# EAGLE design TelemetryECU rev2 (EAGLE 9.5.0)

## Sheet 1 of 3: Teensy, Power, and I/O
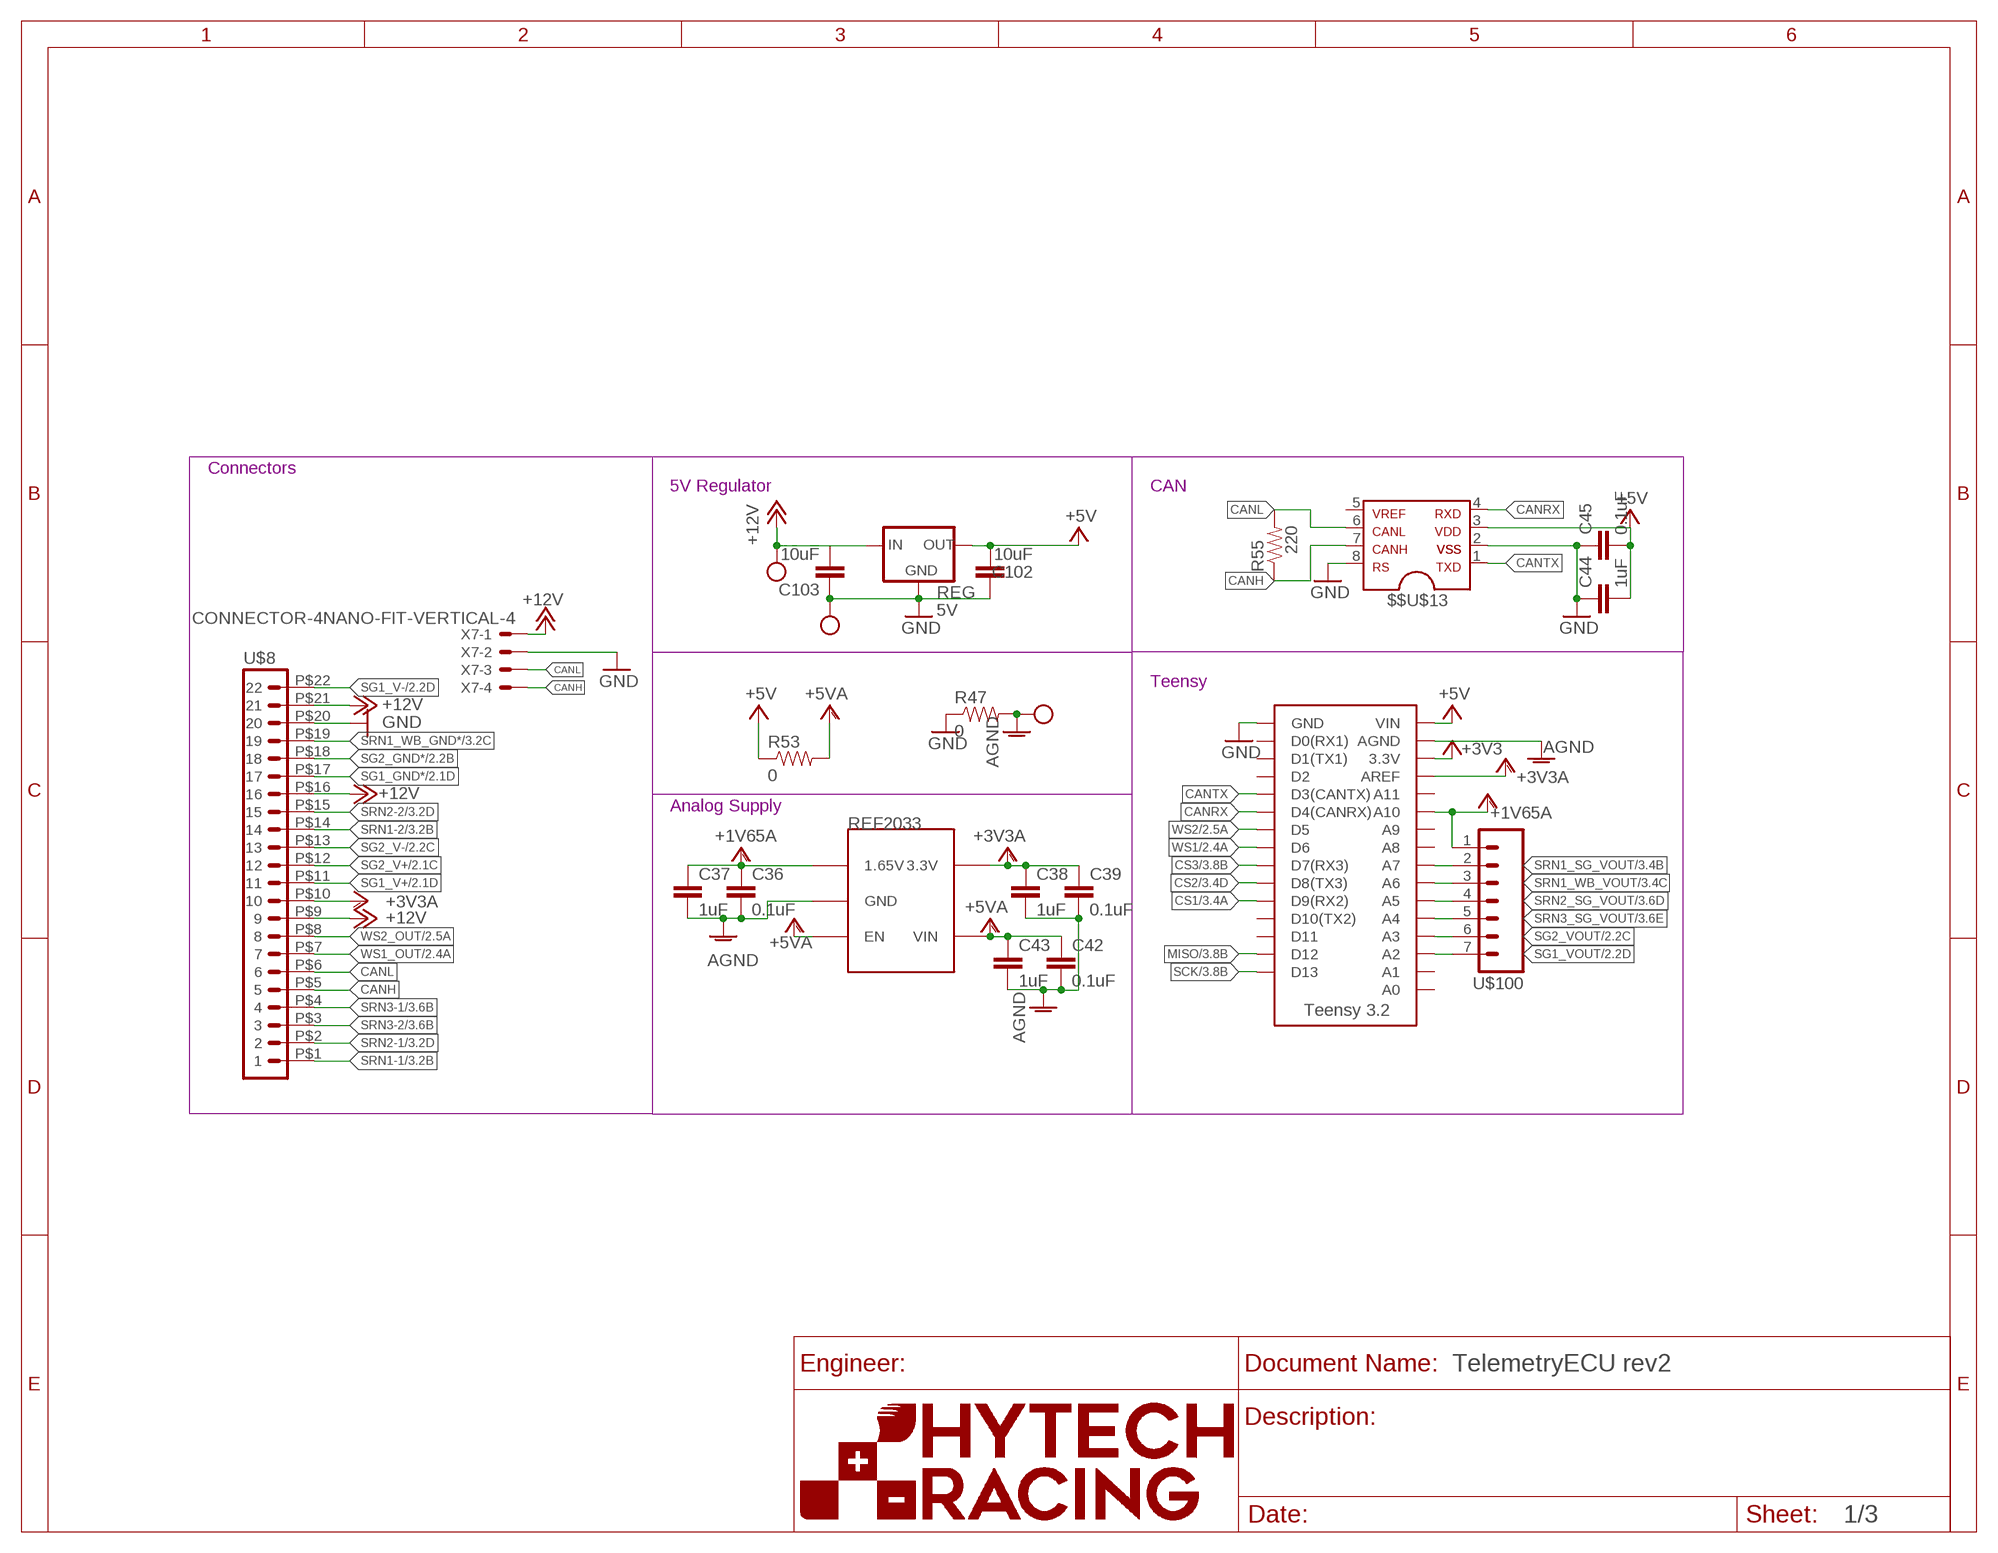
[diagram p0: schematic, sheet 1]
U$13 (FRAME_A_L): ORIENTATION: LANDSCAPE; SIZE: A

### Parts
$$U$11  TEST_POINT  [TEST_POINT]
$$U$13  MCP2551  [SOIC-08]
C36  0.1uF  CAP0603-CAP  [0603-CAP]
C37  1uF  CAP0603-CAP  [0603-CAP]
C38  1uF  CAP0603-CAP  [0603-CAP]
C39  0.1uF  CAP0603-CAP  [0603-CAP]
C42  0.1uF  CAP0603-CAP  [0603-CAP]
C43  1uF  CAP0603-CAP  [0603-CAP]
C44  1uF  CAP0603-CAP  [0603-CAP]
C45  0.1uF  CAP0603-CAP  [0603-CAP]
C102  10uF  CAP0603-CAP  [0603-CAP]
C103  10uF  CAP0603-CAP  [0603-CAP]
R47  0  RESISTOR0603  [0603-RES]
R53  0  RESISTOR0603  [0603-RES]
R55  220  RESISTOR0603-RES  [0603-RES]
REG  5V  OKI-78SR-5  [OKI-78SR]
U$7  REF2033  [SOT-23-5]
U$8  CONNECTOR-22  [AUTOSPORT_12-35]
U$9  TEST_POINT  [TEST_POINT]
U$10  TEST_POINT  [TEST_POINT]
U$14  TEENSY_3.2_EXT_12ANALOG_AREF  [TEENSY_3.2_EXT_12ANALOG_AREF]
U$100  M07  [1X07]
X7  CONNECTOR-4NANO-FIT-VERTICAL-4  [NANO-FIT_VERTICAL-4]

### Nets
+1V65A: C36.1 C37.1 U$7.1(1.65V) U$14.A10 U$100.1 ; also sheet 2,3
+3V3: U$14.3.3V ; also sheet 2,3
+3V3A: C38.1 C39.1 U$7.5(3.3V) U$8.P$10 U$14.AREF ; also sheet 2,3
+5V: $$U$13.3 C44.2 C45.2 C102.2 R53.1 REG.3(OUT) U$14.VIN
+5VA: C42.1 C43.1 R53.2 U$7.3(EN) U$7.4(VIN) ; also sheet 2,3
+12V: C103.2 REG.1(IN) U$8.P$9 U$8.P$16 U$8.P$21 U$10.P$1 X7.P$1
AGND: $$U$11.P$1 C36.2 C37.2 C38.2 C39.2 C42.2 C43.2 R47.2 U$7.2(GND) U$14.AGND ; also sheet 2,3
CANH: $$U$13.7 R55.1 U$8.P$5 X7.P$4
CANL: $$U$13.6 R55.2 U$8.P$6 X7.P$3
CANRX: $$U$13.4 U$14.D4(CANRX)
CANTX: $$U$13.1 U$14.D3(CANTX)
CS1: U$14.D9(RX2) ; also sheet 3
CS2: U$14.D8(TX3) ; also sheet 3
CS3: U$14.D7(RX3) ; also sheet 3
GND: $$U$13.2 $$U$13.8 C44.1 C45.1 C102.1 C103.1 R47.1 REG.2(GND) U$8.P$20 U$9.P$1 U$14.GND X7.P$2 ; also sheet 2,3
MISO: U$14.D12 ; also sheet 3
SCK: U$14.D13 ; also sheet 3
SG1_GND*: U$8.P$17 ; also sheet 2
SG1_V+: U$8.P$11 ; also sheet 2
SG1_V-: U$8.P$22 ; also sheet 2
SG1_VOUT: U$14.A2 U$100.7 ; also sheet 2
SG2_GND*: U$8.P$18 ; also sheet 2
SG2_V+: U$8.P$12 ; also sheet 2
SG2_V-: U$8.P$13 ; also sheet 2
SG2_VOUT: U$14.A3 U$100.6 ; also sheet 2
SRN1-1: U$8.P$1 ; also sheet 3
SRN1-2: U$8.P$14 ; also sheet 3
SRN1_SG_VOUT: U$14.A7 U$100.2 ; also sheet 3
SRN1_WB_GND*: U$8.P$19 ; also sheet 3
SRN1_WB_VOUT: U$14.A6 U$100.3 ; also sheet 3
SRN2-1: U$8.P$2 ; also sheet 3
SRN2-2: U$8.P$15 ; also sheet 3
SRN2_SG_VOUT: U$14.A5 U$100.4 ; also sheet 3
SRN3-1: U$8.P$4 ; also sheet 3
SRN3-2: U$8.P$3 ; also sheet 3
SRN3_SG_VOUT: U$14.A4 U$100.5 ; also sheet 3
WS1: U$14.D6 ; also sheet 2
WS1_OUT: U$8.P$7 ; also sheet 2
WS2: U$14.D5 ; also sheet 2
WS2_OUT: U$8.P$8 ; also sheet 2
Unconnected: $$U$13.5 U$14.A0 U$14.A1 U$14.A8 U$14.A9 U$14.A11 U$14.D0(RX1) U$14.D1(TX1) U$14.D2 U$14.D10(TX2) U$14.D11

### Notes on the sheet
- Connectors
- 5V Regulator | CAN
- Teensy
- Analog Supply

## Sheet 2 of 3: Dedicated Hardware
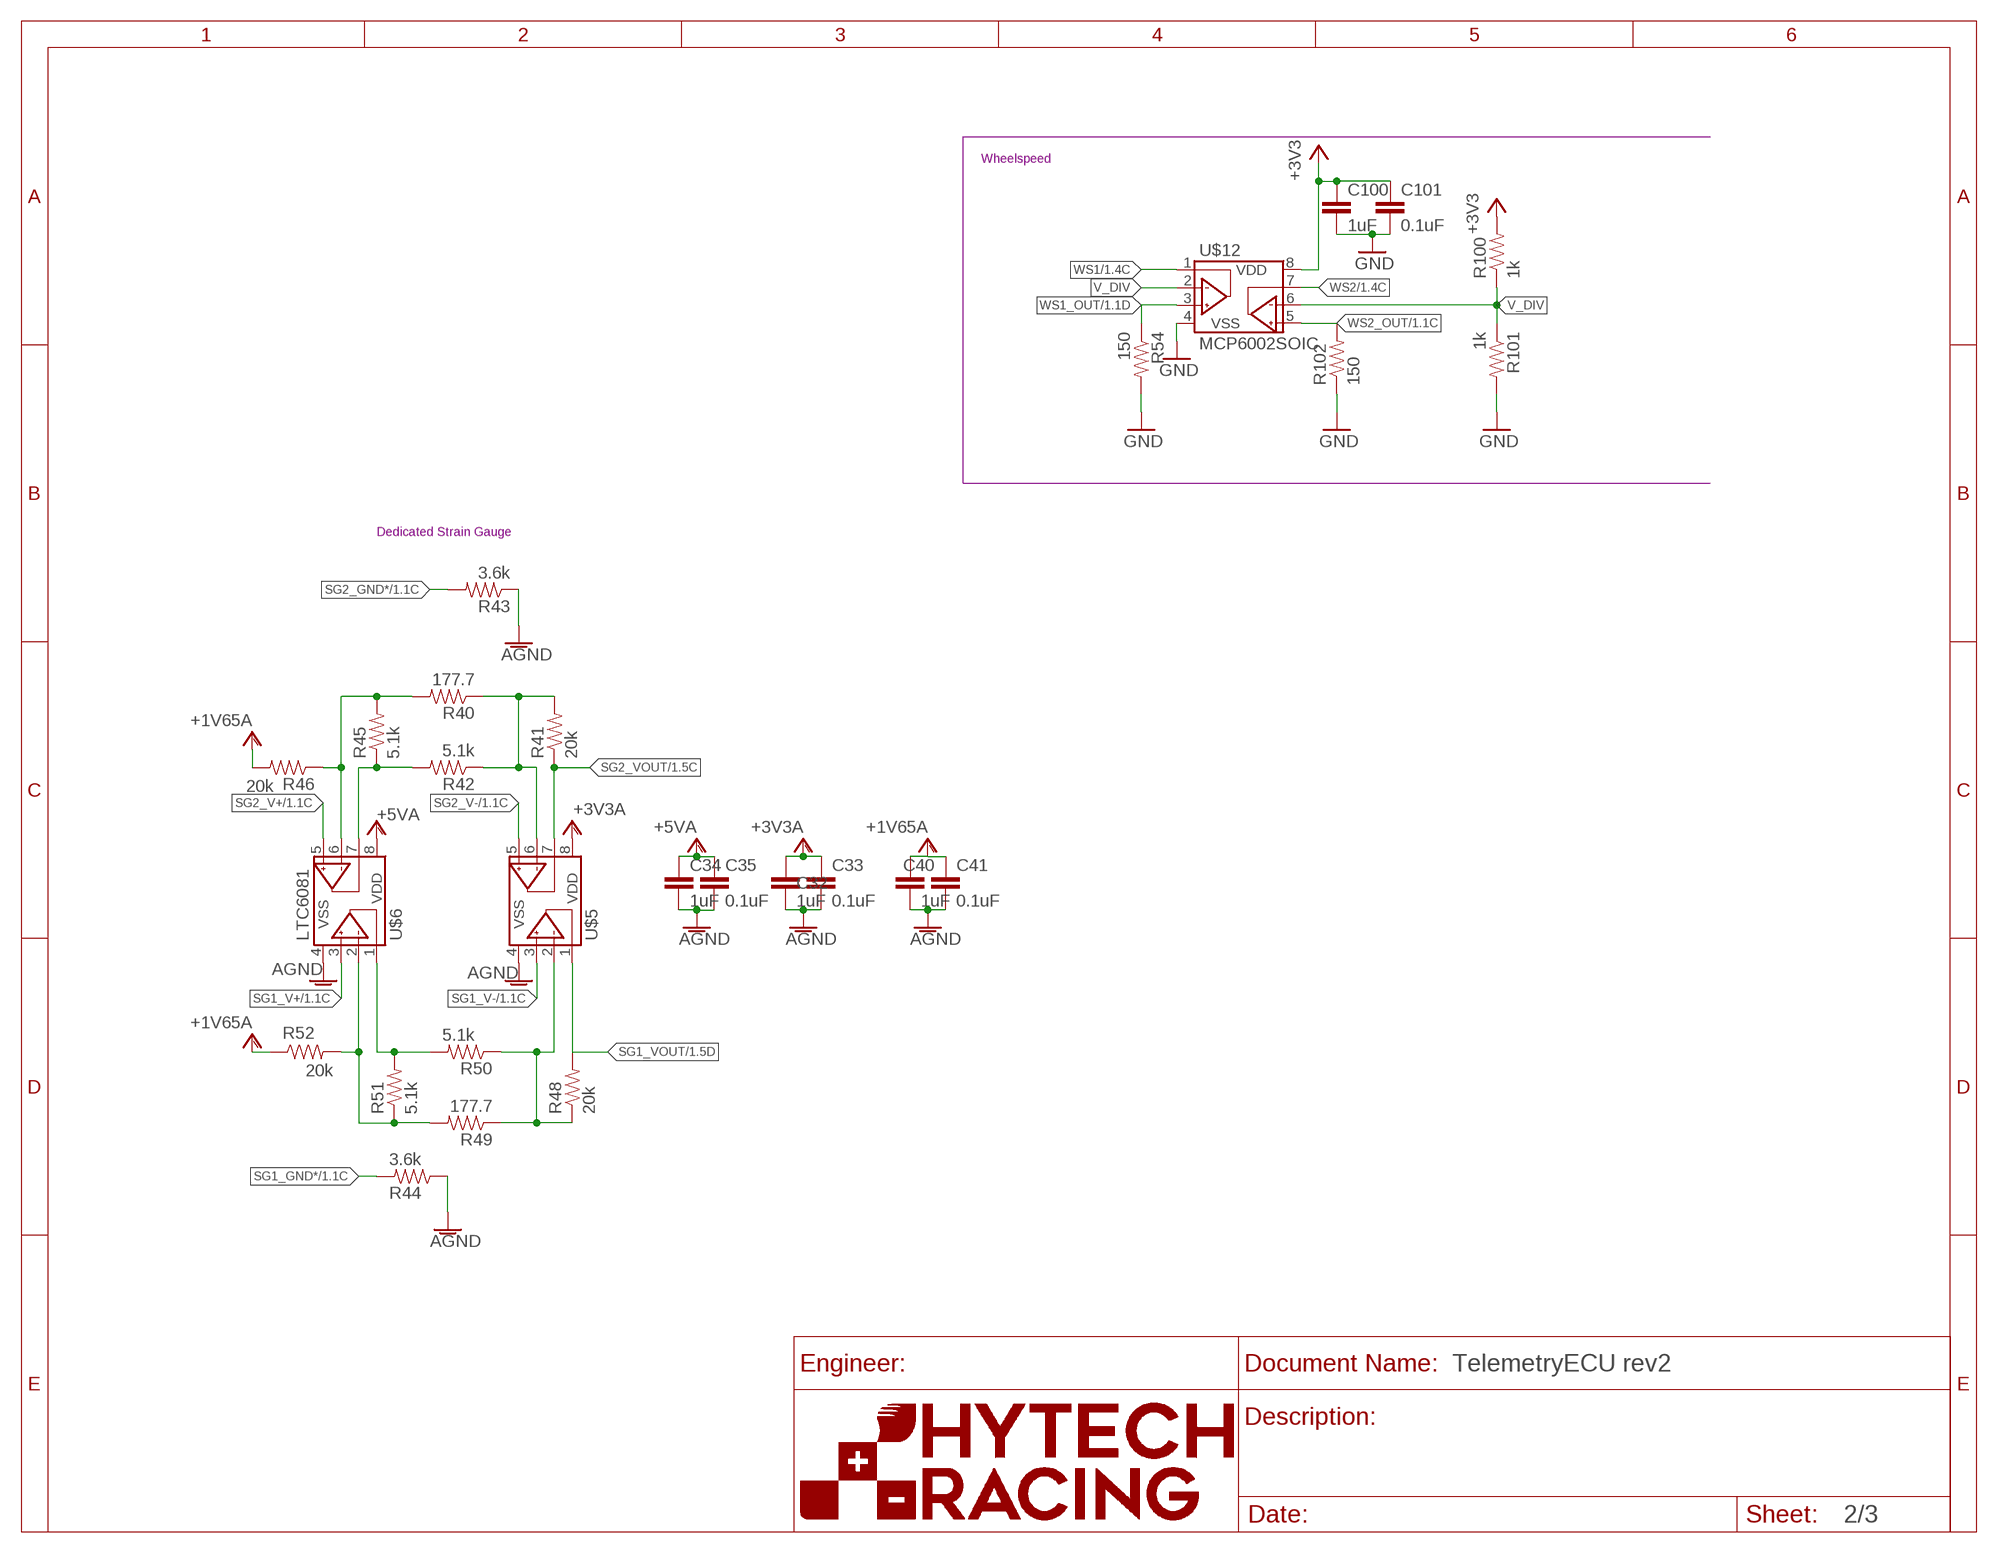
[diagram p1: schematic, sheet 2]
U$18 (FRAME_A_L): ORIENTATION: LANDSCAPE; SIZE: A

### Parts
C32  1uF  CAP0603-CAP  [0603-CAP]
C33  0.1uF  CAP0603-CAP  [0603-CAP]
C34  1uF  CAP0603-CAP  [0603-CAP]
C35  0.1uF  CAP0603-CAP  [0603-CAP]
C40  1uF  CAP0603-CAP  [0603-CAP]
C41  0.1uF  CAP0603-CAP  [0603-CAP]
C100  1uF  CAP0603-CAP  [0603-CAP]
C101  0.1uF  CAP0603-CAP  [0603-CAP]
R40  177.7  RESISTOR0603-RES  [0603-RES]
R41  20k  RESISTOR0603-RES  [0603-RES]
R42  5.1k  RESISTOR0603-RES  [0603-RES]
R43  3.6k  RESISTOR0603-RES  [0603-RES]
R44  3.6k  RESISTOR0603-RES  [0603-RES]
R45  5.1k  RESISTOR0603-RES  [0603-RES]
R46  20k  RESISTOR0603-RES  [0603-RES]
R48  20k  RESISTOR0603-RES  [0603-RES]
R49  177.7  RESISTOR0603-RES  [0603-RES]
R50  5.1k  RESISTOR0603-RES  [0603-RES]
R51  5.1k  RESISTOR0603-RES  [0603-RES]
R52  20k  RESISTOR0603-RES  [0603-RES]
R54  150  RESISTOR0603-RES  [0603-RES]
R100  1k  RESISTOR0603-RES  [0603-RES]
R101  1k  RESISTOR0603-RES  [0603-RES]
R102  150  RESISTOR0603-RES  [0603-RES]
U$5  LTC6081  [MSOP-8_MS]
U$6  LTC6081  [MSOP-8_MS]
U$12  MCP6002SOIC  [SOIC-08]

### Nets
+1V65A: C40.1 C41.1 R46.2 R52.1 ; also sheet 1,3
+3V3: C100.1 C101.1 R100.2 U$12.8(VDD) ; also sheet 1,3
+3V3A: C32.1 C33.1 U$5.8(VDD) ; also sheet 1,3
+5VA: C34.1 C35.1 U$6.8(VDD) ; also sheet 1,3
AGND: C32.2 C33.2 C34.2 C35.2 C40.2 C41.2 R43.1 R44.1 U$5.4(VSS) U$6.4(VSS) ; also sheet 1,3
GND: C100.2 C101.2 R54.2 R101.2 R102.1 U$12.4(VSS) ; also sheet 1,3
N$1: R50.2 R51.2 U$6.1(VOUTA)
N$3: R49.2 R51.1 R52.2 U$6.2(VINA-)
N$4: R40.2 R45.2 R46.1 U$6.6(VINB-)
N$5: R48.1 R49.1 R50.1 U$5.2(VINA-)
N$8: R42.2 R45.1 U$6.7(VOUTB)
N$9: R40.1 R41.2 R42.1 U$5.6(VINB-)
SG1_GND*: R44.2 ; also sheet 1
SG1_V+: U$6.3(VINA+) ; also sheet 1
SG1_V-: U$5.3(VINA+) ; also sheet 1
SG1_VOUT: R48.2 U$5.1(VOUTA) ; also sheet 1
SG2_GND*: R43.2 ; also sheet 1
SG2_V+: U$6.5(VINB+) ; also sheet 1
SG2_V-: U$5.5(VINB+) ; also sheet 1
SG2_VOUT: R41.1 U$5.7(VOUTB) ; also sheet 1
V_DIV: R100.1 R101.1 U$12.2(VINA-) U$12.6(VINB-)
WS1: U$12.1(VOUTA) ; also sheet 1
WS1_OUT: R54.1 U$12.3(VINA+) ; also sheet 1
WS2: U$12.7(VOUTB) ; also sheet 1
WS2_OUT: R102.2 U$12.5(VINB+) ; also sheet 1

### Notes on the sheet
- Wheelspeed
- Dedicated Strain Gauge

## Sheet 3 of 3: Flexible Hardware
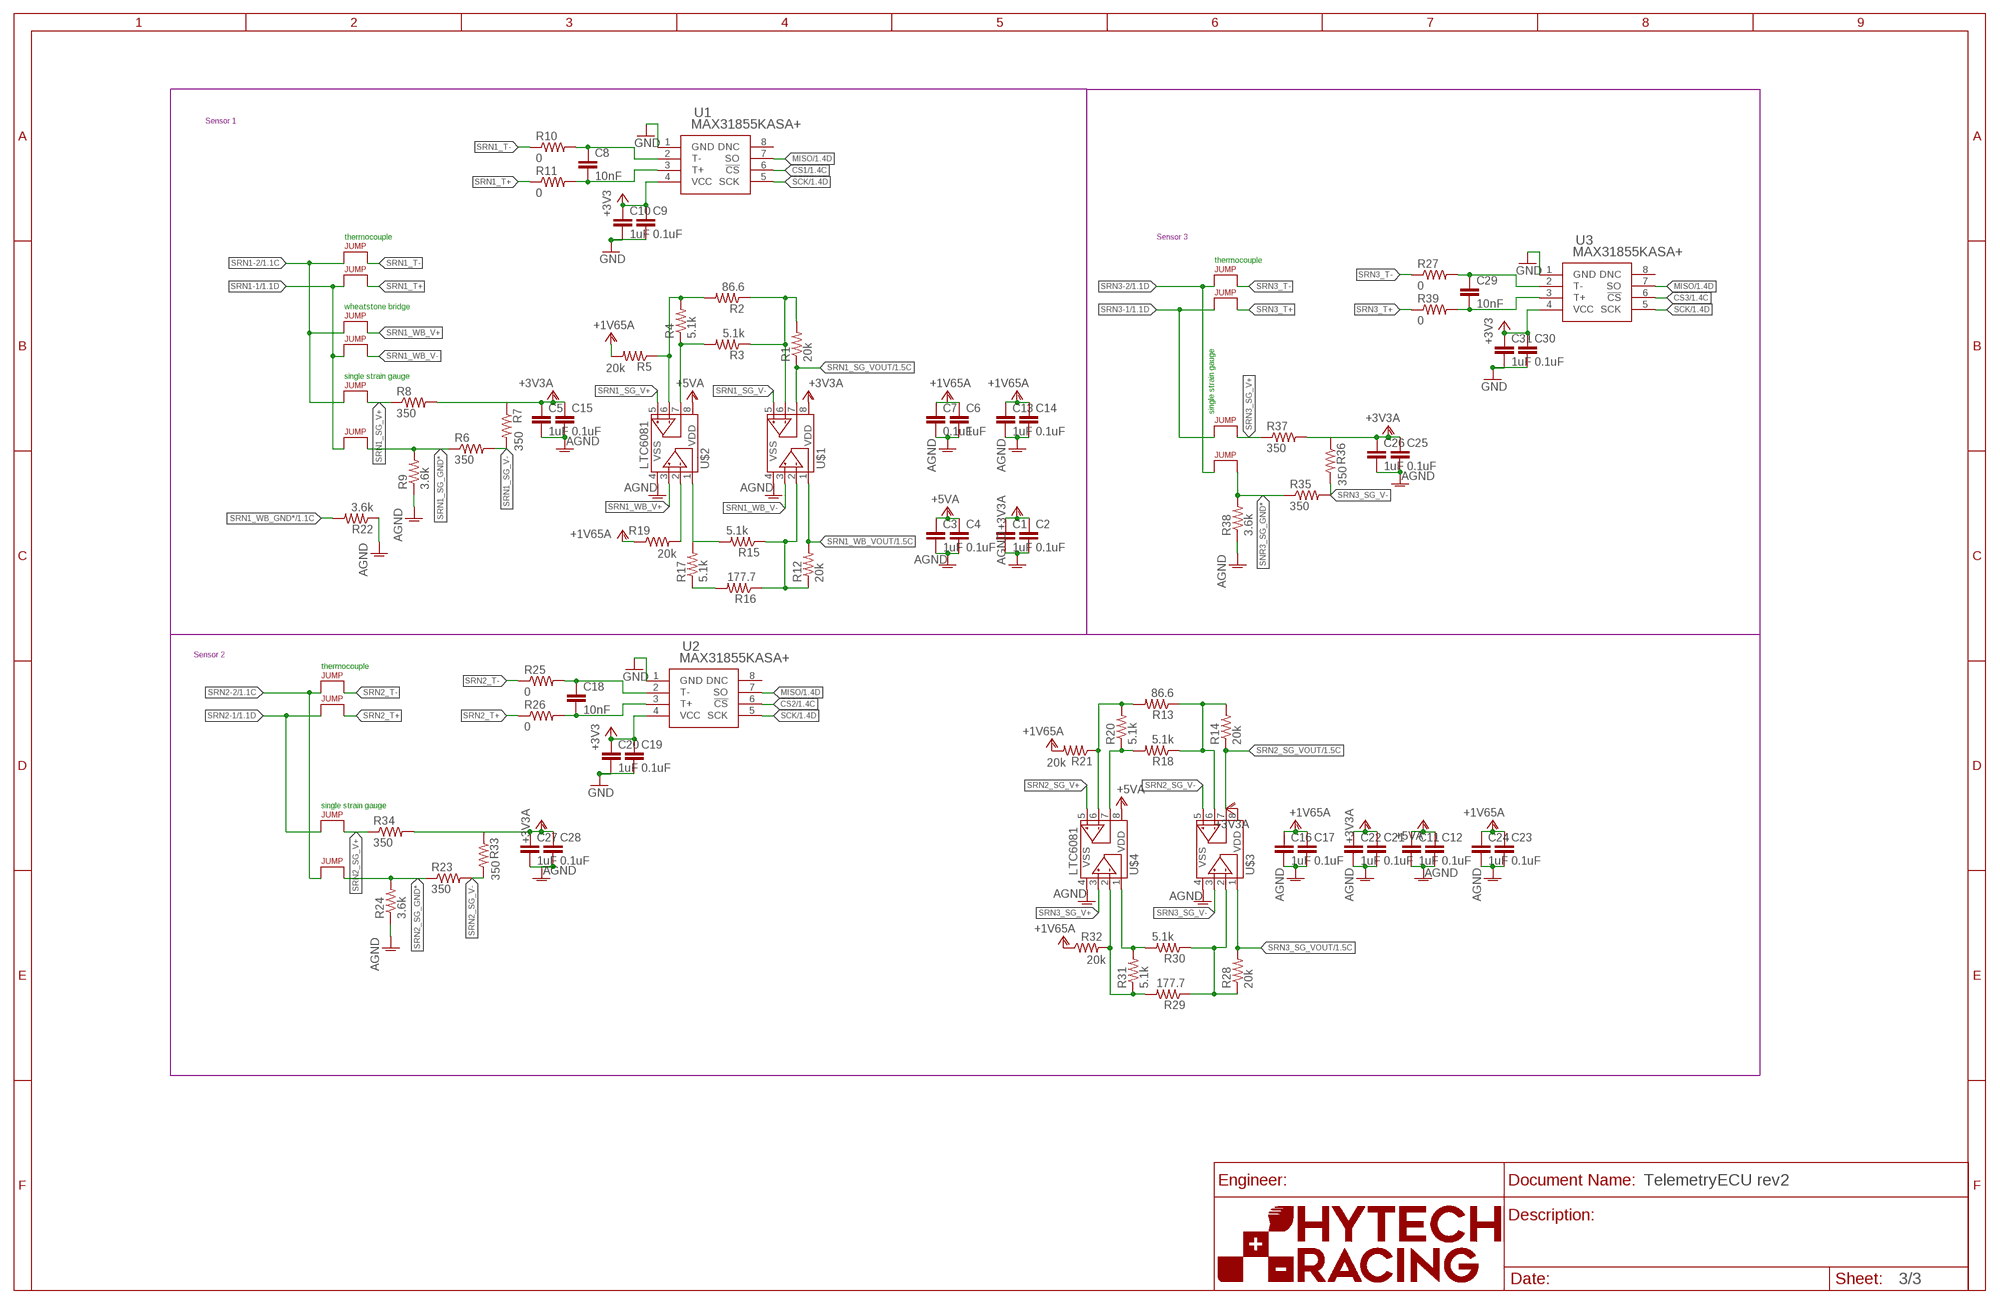
[diagram p2: schematic, sheet 3]
U$26 (FRAME_B_L): ORIENTATION: LANDSCAPE; SIZE: B

### Parts
C1  1uF  CAP0603-CAP  [0603-CAP]
C2  0.1uF  CAP0603-CAP  [0603-CAP]
C3  1uF  CAP0603-CAP  [0603-CAP]
C4  0.1uF  CAP0603-CAP  [0603-CAP]
C5  1uF  CAP0603-CAP  [0603-CAP]
C6  1uF  CAP0603-CAP  [0603-CAP]
C7  0.1uF  CAP0603-CAP  [0603-CAP]
C8  10nF  CAP0603-CAP  [0603-CAP]
C9  0.1uF  CAP0603-CAP  [0603-CAP]
C10  1uF  CAP0603-CAP  [0603-CAP]
C11  1uF  CAP0603-CAP  [0603-CAP]
C12  0.1uF  CAP0603-CAP  [0603-CAP]
C13  1uF  CAP0603-CAP  [0603-CAP]
C14  0.1uF  CAP0603-CAP  [0603-CAP]
C15  0.1uF  CAP0603-CAP  [0603-CAP]
C16  1uF  CAP0603-CAP  [0603-CAP]
C17  0.1uF  CAP0603-CAP  [0603-CAP]
C18  10nF  CAP0603-CAP  [0603-CAP]
C19  0.1uF  CAP0603-CAP  [0603-CAP]
C20  1uF  CAP0603-CAP  [0603-CAP]
C21  0.1uF  CAP0603-CAP  [0603-CAP]
C22  1uF  CAP0603-CAP  [0603-CAP]
C23  0.1uF  CAP0603-CAP  [0603-CAP]
C24  1uF  CAP0603-CAP  [0603-CAP]
C25  0.1uF  CAP0603-CAP  [0603-CAP]
C26  1uF  CAP0603-CAP  [0603-CAP]
C27  1uF  CAP0603-CAP  [0603-CAP]
C28  0.1uF  CAP0603-CAP  [0603-CAP]
C29  10nF  CAP0603-CAP  [0603-CAP]
C30  0.1uF  CAP0603-CAP  [0603-CAP]
C31  1uF  CAP0603-CAP  [0603-CAP]
J1  JUMPER.1  [1X02]
J2  JUMPER.1  [1X02]
J3  JUMPER.1  [1X02]
J4  JUMPER.1  [1X02]
J5  JUMPER.1  [1X02]
J6  JUMPER.1  [1X02]
J7  JUMPER.1  [1X02]
J8  JUMPER.1  [1X02]
J9  JUMPER.1  [1X02]
J10  JUMPER.1  [1X02]
J11  JUMPER.1  [1X02]
J12  JUMPER.1  [1X02]
J13  JUMPER.1  [1X02]
J14  JUMPER.1  [1X02]
R1  20k  RESISTOR0603-RES  [0603-RES]
R2  86.6  RESISTOR0603-RES  [0603-RES]
R3  5.1k  RESISTOR0603-RES  [0603-RES]
R4  5.1k  RESISTOR0603-RES  [0603-RES]
R5  20k  RESISTOR0603-RES  [0603-RES]
R6  350  RESISTOR0603-RES  [0603-RES]
R7  350  RESISTOR0603-RES  [0603-RES]
R8  350  RESISTOR0603-RES  [0603-RES]
R9  3.6k  RESISTOR0603-RES  [0603-RES]
R10  0  RESISTOR0603  [0603-RES]
R11  0  RESISTOR0603  [0603-RES]
R12  20k  RESISTOR0603-RES  [0603-RES]
R13  86.6  RESISTOR0603-RES  [0603-RES]
R14  20k  RESISTOR0603-RES  [0603-RES]
R15  5.1k  RESISTOR0603-RES  [0603-RES]
R16  177.7  RESISTOR0603-RES  [0603-RES]
R17  5.1k  RESISTOR0603-RES  [0603-RES]
R18  5.1k  RESISTOR0603-RES  [0603-RES]
R19  20k  RESISTOR0603-RES  [0603-RES]
R20  5.1k  RESISTOR0603-RES  [0603-RES]
R21  20k  RESISTOR0603-RES  [0603-RES]
R22  3.6k  RESISTOR0603-RES  [0603-RES]
R23  350  RESISTOR0603-RES  [0603-RES]
R24  3.6k  RESISTOR0603-RES  [0603-RES]
R25  0  RESISTOR0603  [0603-RES]
R26  0  RESISTOR0603  [0603-RES]
R27  0  RESISTOR0603  [0603-RES]
R28  20k  RESISTOR0603-RES  [0603-RES]
R29  177.7  RESISTOR0603-RES  [0603-RES]
R30  5.1k  RESISTOR0603-RES  [0603-RES]
R31  5.1k  RESISTOR0603-RES  [0603-RES]
R32  20k  RESISTOR0603-RES  [0603-RES]
R33  350  RESISTOR0603-RES  [0603-RES]
R34  350  RESISTOR0603-RES  [0603-RES]
R35  350  RESISTOR0603-RES  [0603-RES]
R36  350  RESISTOR0603-RES  [0603-RES]
R37  350  RESISTOR0603-RES  [0603-RES]
R38  3.6k  RESISTOR0603-RES  [0603-RES]
R39  0  RESISTOR0603  [0603-RES]
U1  MAX31855KASA+  [21-0041B_8]
U2  MAX31855KASA+  [21-0041B_8]
U3  MAX31855KASA+  [21-0041B_8]
U$1  LTC6081  [MSOP-8_MS]
U$2  LTC6081  [MSOP-8_MS]
U$3  LTC6081  [MSOP-8_MS]
U$4  LTC6081  [MSOP-8_MS]

### Nets
+1V65A: C6.1 C7.1 C13.1 C14.1 C16.1 C17.1 C23.1 C24.1 R5.2 R19.1 R21.2 R32.1 ; also sheet 1,2
+3V3: C9.1 C10.1 C19.1 C20.1 C30.1 C31.1 U1.4(VCC) U2.4(VCC) U3.4(VCC) ; also sheet 1,2
+3V3A: C1.1 C2.1 C5.1 C15.1 C21.1 C22.1 C25.1 C26.1 C27.1 C28.1 R7.1 R8.2 R33.1 R34.2 R36.1 R37.2 U$1.8(VDD) U$3.8(VDD) ; also sheet 1,2
+5VA: C3.1 C4.1 C11.1 C12.1 U$2.8(VDD) U$4.8(VDD) ; also sheet 1,2
AGND: C1.2 C2.2 C3.2 C4.2 C5.2 C6.2 C7.2 C11.2 C12.2 C13.2 C14.2 C15.2 C16.2 C17.2 C21.2 C22.2 C23.2 C24.2 C25.2 C26.2 C27.2 C28.2 R9.1 R22.1 R24.1 R38.1 U$1.4(VSS) U$2.4(VSS) U$3.4(VSS) U$4.4(VSS) ; also sheet 1,2
CS1: U1.6(!CS) ; also sheet 1
CS2: U2.6(!CS) ; also sheet 1
CS3: U3.6(!CS) ; also sheet 1
GND: C9.2 C10.2 C19.2 C20.2 C30.2 C31.2 U1.1(GND) U2.1(GND) U3.1(GND) ; also sheet 1,2
MISO: U1.7(SO) U2.7(SO) U3.7(SO) ; also sheet 1
N$2: C8.1 R10.2 U1.2(T-)
N$6: C8.2 R11.2 U1.3(T+)
N$10: R16.2 R17.1 R19.2 U$2.2(VINA-)
N$11: R2.2 R4.2 R5.1 U$2.6(VINB-)
N$12: R15.2 R17.2 U$2.1(VOUTA)
N$13: R12.1 R15.1 R16.1 U$1.2(VINA-)
N$14: R3.2 R4.1 U$2.7(VOUTB)
N$15: C18.1 R25.2 U2.2(T-)
N$16: C18.2 R26.2 U2.3(T+)
N$17: R29.2 R31.1 R32.2 U$4.2(VINA-)
N$18: R13.2 R20.2 R21.1 U$4.6(VINB-)
N$19: R30.2 R31.2 U$4.1(VOUTA)
N$21: R28.1 R29.1 R30.1 U$3.2(VINA-)
N$22: R18.2 R20.1 U$4.7(VOUTB)
N$23: R13.1 R14.2 R18.1 U$3.6(VINB-)
N$25: C29.1 R27.2 U3.2(T-)
N$26: C29.2 R39.2 U3.3(T+)
N$77: R1.2 R2.1 R3.1 U$1.6(VINB-)
SCK: U1.5(SCK) U2.5(SCK) U3.5(SCK) ; also sheet 1
SNR3_SG_GND*: J12.2 R35.1 R38.2
SRN1-1: J2.1 J5.1 J6.1 ; also sheet 1
SRN1-2: J1.1 J3.1 J4.1 ; also sheet 1
SRN1_SG_GND*: J2.2 R6.1 R9.2
SRN1_SG_V+: J1.2 R8.1 U$2.5(VINB+)
SRN1_SG_V-: R6.2 R7.2 U$1.5(VINB+)
SRN1_SG_VOUT: R1.1 U$1.7(VOUTB) ; also sheet 1
SRN1_T+: J5.2 R11.1
SRN1_T-: J4.2 R10.1
SRN1_WB_GND*: R22.2 ; also sheet 1
SRN1_WB_V+: J3.2 U$2.3(VINA+)
SRN1_WB_V-: J6.2 U$1.3(VINA+)
SRN1_WB_VOUT: R12.2 U$1.1(VOUTA) ; also sheet 1
SRN2-1: J8.1 J10.1 ; also sheet 1
SRN2-2: J7.1 J9.1 ; also sheet 1
SRN2_SG_GND*: J7.2 R23.1 R24.2
SRN2_SG_V+: J8.2 R34.1 U$4.5(VINB+)
SRN2_SG_V-: R23.2 R33.2 U$3.5(VINB+)
SRN2_SG_VOUT: R14.1 U$3.7(VOUTB) ; also sheet 1
SRN2_T+: J10.2 R26.1
SRN2_T-: J9.2 R25.1
SRN3-1: J13.1 J14.1 ; also sheet 1
SRN3-2: J11.1 J12.1 ; also sheet 1
SRN3_SG_V+: J13.2 R37.1 U$4.3(VINA+)
SRN3_SG_V-: R35.2 R36.2 U$3.3(VINA+)
SRN3_SG_VOUT: R28.2 U$3.1(VOUTA) ; also sheet 1
SRN3_T+: J14.2 R39.1
SRN3_T-: J11.2 R27.1
Unconnected: U1.8(DNC) U2.8(DNC) U3.8(DNC)

### Notes on the sheet
- Sensor 1
- thermocouple | Sensor 3
- thermocouple
- wheatstone bridge
- single strain gauge
- single strain gauge
- Sensor 2
- thermocouple
- single strain gauge

## Library data of the parts
$$U$11 U$9 U$10 = HyTechDevices:TEST_POINT: Keystone Electronics Test Point 5005
$$U$13 = HyTechDevices:MCP2551: MCP2551 High-Speed CAN Transceiver Product Webpage <https://www.microchip.com/wwwproducts/en/MCP2551> Datasheet <http://ww1.microchip.com/downloads/en/DeviceDoc/21667f.pdf> This device is outdated It is replaced by MCP2561. Comparison Page <https://www.microchip.com/wwwproducts/ProductCompare/MCP2551/MCP2561> Product Webpage <https://www.microchip.com/wwwproducts/en/MCP2561> Datasheet <http://ww1.microchip.com/downloads/en/DeviceDoc/20005167C.pdf>
C1-C45 C100-C103 = HyTechDevices:CAP: Capacitor Standard 0603 ceramic capacitor, and 0.1" leaded capacitor.
J1-J14 = HyTechDevices:JUMPER: Jumper for changing operation of a device
R1-R55 R100-R102 = HyTechDevices:RESISTOR: Resistor Basic schematic elements and footprints for 0603, 1206, and PTH resistors.
REG = HyTechDevices:OKI-78SR-5: Murata OKI-78SR 5V 1.5A Non-Isolated Switching Regulator DC/DC - Datasheet <https://power.murata.com/data/power/oki-78sr.pdf>
U1-U3 = HyTechDevices:MAX31855KASA+; MANUFACTURER_PART_NUMBER: MAX31855KASA+; VENDOR: Maxim Integrated Products
U$1-U$6 = HyTechDevices:LTC6081
U$7 = HyTechDevices:REF2033
U$8 = HyTechDevices:CONNECTOR-22: 22-pin Autosport connector; PINS: 22
U$12 = HyTechDevices:MCP6002: Microchip MCP6002 Dual Channel Op Amp
U$14 = HyTechDevices:TEENSY_3.2_EXT_12ANALOG_AREF
U$100 = HyTechDevices:M07
X7 = HyTechDevices:CONNECTOR-4: Mini-Fit Junior connector 4 pole Source: http://www.molex.com

## Board
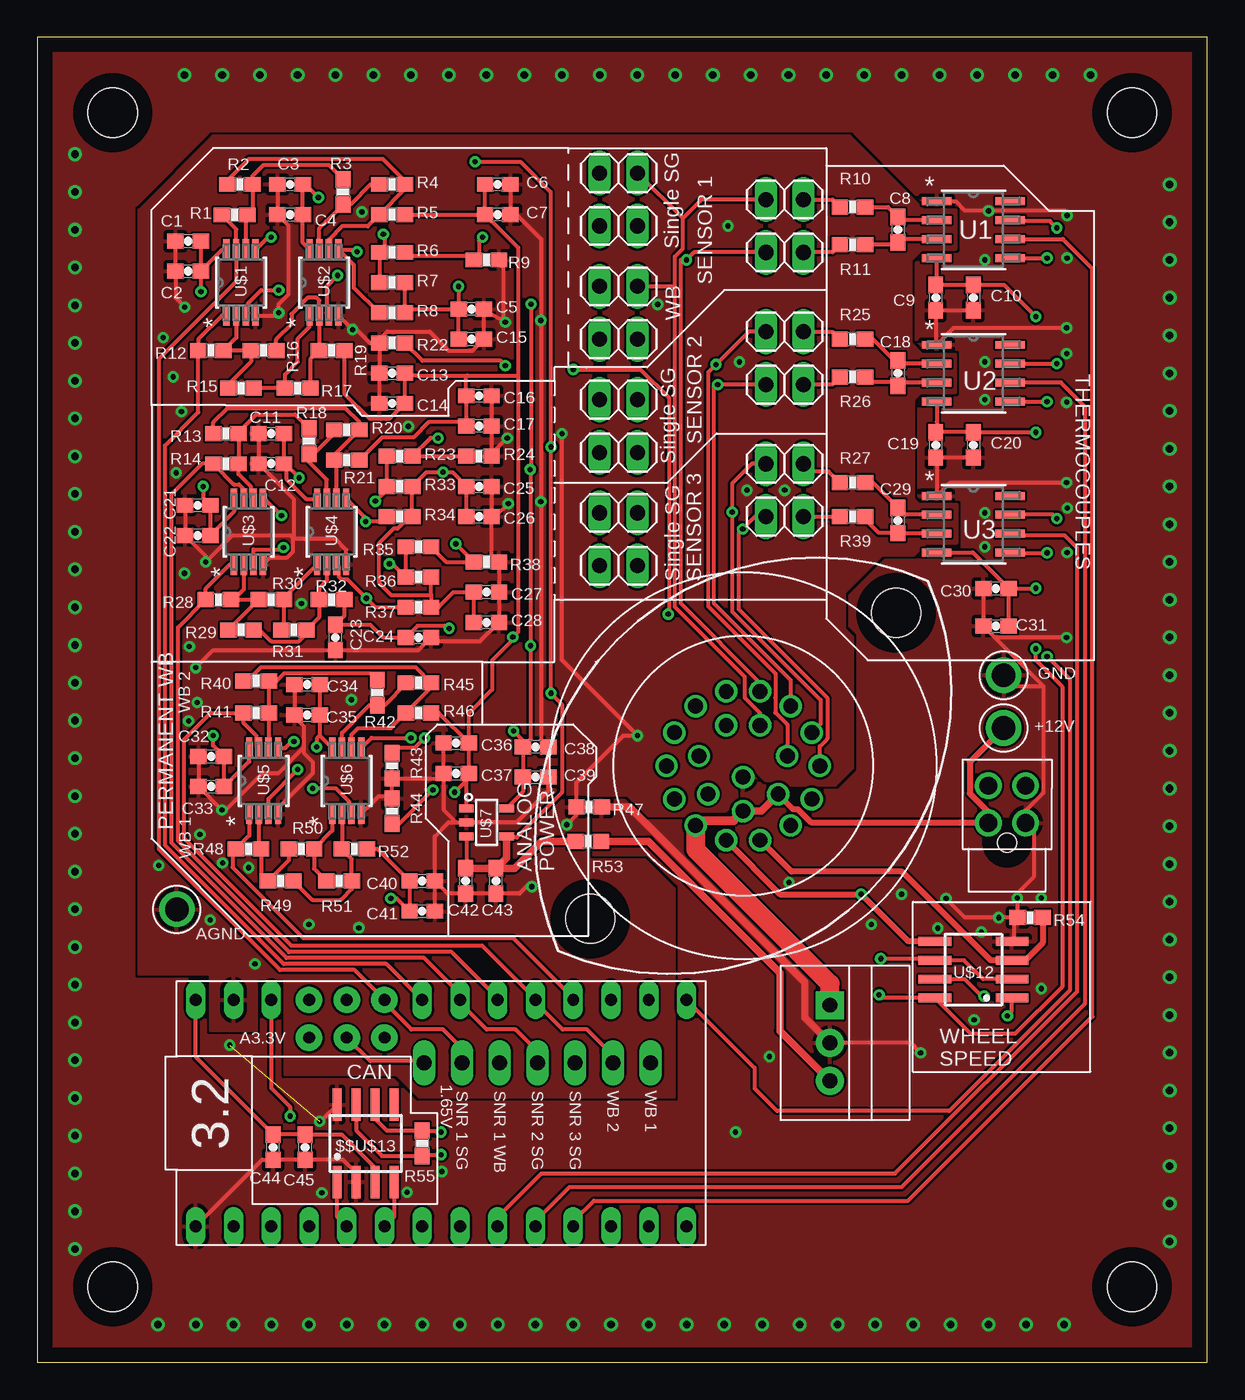
[diagram p3: board, top side]
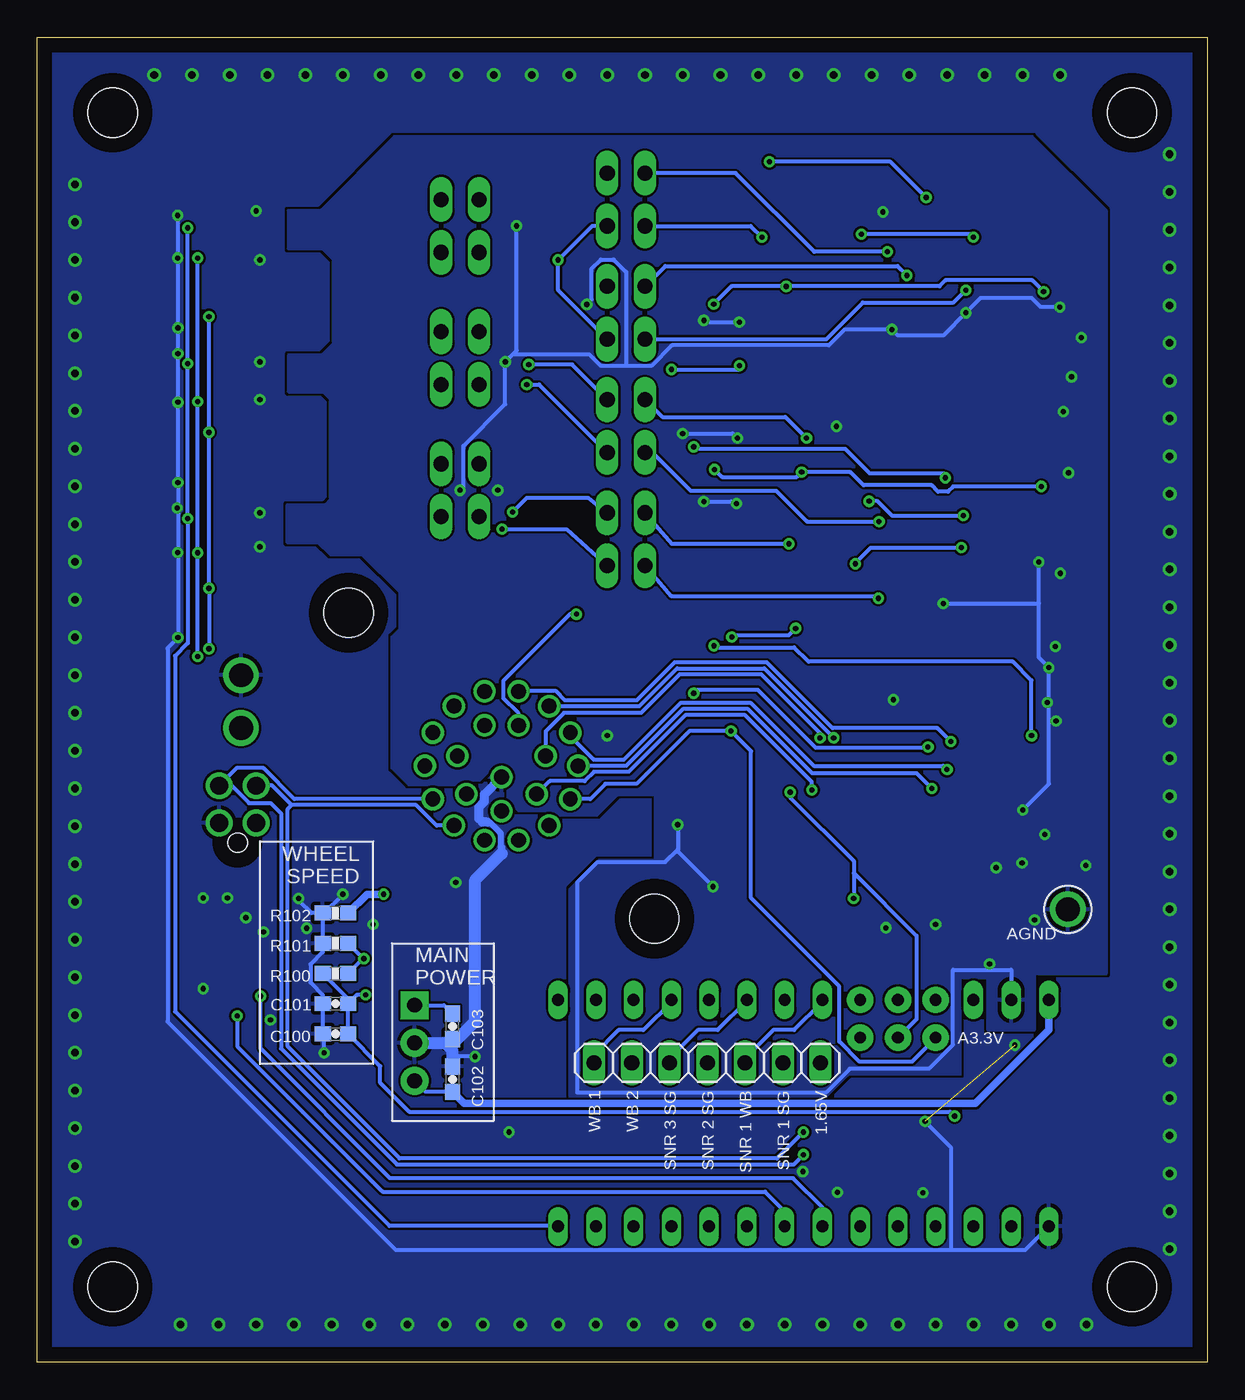
[diagram p4: board, bottom side, seen from below]

Size 78.74 x 89.15 mm. Coordinates in mm from the lower left corner, seen from the top.
Outline: 0,0 78.74,0 78.74,89.15 0,89.15 0,0
Copper layers (1*16): Top 0.035mm / dielectric 1.5mm / Bottom 0.035mm
Design rules "DRC Advanced Circuits": minimum track width 6mil, minimum drill 10mil, track to track 6mil, track to pad 6mil, pad to pad 6mil, via to via 6mil, smd to smd 6mil, copper to edge 40mil, drill to drill 6mil, minimum pad ring 10mil, minimum via ring 8mil, stop-mask expansion 4mil, vias tented up to drill 0mil, thermal gap 10mil
Holes 3.3 mm at 5.08,84.07 5.08,5.08 73.66,84.07 73.66,5.08

### Footprints (pad centres in the part's own frame; a part is rotated, then mirrored left to right if it is on the bottom)
TEST_POINT = drill 1.6: P$1 0,0
SOIC-08 = smd 0.6 x 2.2: 1 -1.905,-2.6; 2 -0.635,-2.6; 3 0.635,-2.6; 4 1.905,-2.6; 5 1.905,2.6; 6 0.635,2.6; 7 -0.635,2.6; 8 -1.905,2.6
0603-CAP = smd 1.1 x 1: 1 -0.85,0; 2 0.85,0
1X02 = drill 1.016 long: 1 -1.27,0; 2 1.27,0
0603-RES = smd 1.1 x 1: 1 -0.85,0; 2 0.85,0
OKI-78SR = drill 1 pad 1.88 square: 1 -2.54,0 | drill 1 pad 1.88: 2 0,0; 3 2.54,0
21-0041B_8 = smd 1.981 x 0.533: 1 -2.464,1.905; 2 -2.464,0.635; 3 -2.464,-0.635; 4 -2.464,-1.905; 5 2.464,-1.905; 6 2.464,-0.635; 7 2.464,0.635; 8 2.464,1.905
MSOP-8_MS = smd 1.397 x 0.432: 1 -2.21,0.975; 2 -2.21,0.325; 3 -2.21,-0.325; 4 -2.21,-0.975; 5 2.21,-0.975; 6 2.21,-0.325; 7 2.21,0.325; 8 2.21,0.975
SOT-23-5 = smd 1 x 0.55: 1 -1.35,0.95; 2 -1.35,0; 3 -1.35,-0.95; 4 1.35,-0.95; 5 1.35,0.95
AUTOSPORT_12-35 = drill 1: P$1 1.143,5.004; P$2 3.2,4.013; P$3 4.623,2.235; P$4 5.156,0; P$5 4.623,-2.235; P$6 3.2,-4.013; P$7 1.143,-5.004; P$8 -1.143,-5.004; P$9 -3.2,-4.013; P$10 -4.623,-2.235; P$11 -5.156,0; P$12 -3.2,4.013; P$13 -1.143,5.004; P$14 1.143,2.718; P$15 2.972,0.66; P$16 2.362,-1.905; P$17 -2.362,-1.905; P$18 -2.972,0.66; P$19 -1.143,2.718; P$20 0,-0.762; P$21 0,-3.048; P$22 -4.623,2.235 | hole 3.3: -10.288,-10.288; 10.288,10.288
TEENSY_3.2_EXT_12ANALOG_AREF = drill 0.8 long: 3.3V 16.51,29.21; A0 16.51,3.81; A1 16.51,6.35; A2 16.51,8.89; A3 16.51,11.43; A4 16.51,13.97; A5 16.51,16.51; A6 16.51,19.05; AGND 16.51,31.75; D0(RX1) 1.27,31.75; D1(TX1) 1.27,29.21; D2 1.27,26.67; D3(CANTX) 1.27,24.13; D4(CANRX) 1.27,21.59; D5 1.27,19.05; D6 1.27,16.51; D7(RX3) 1.27,13.97; D8(TX3) 1.27,11.43; D9(RX2) 1.27,8.89; D10(TX2) 1.27,6.35; D11 1.27,3.81; D12 1.27,1.27; D13 16.51,1.27; GND 1.27,34.29; VIN 16.51,34.29 | drill 0.8 pad 1.778: A7 16.51,21.59; A8 16.51,24.13; A9 16.51,26.67; A10 13.97,24.13; A11 13.97,21.59; AREF 13.97,26.67
1X07 = drill 1.016 long: 1 -7.62,0; 2 -5.08,0; 3 -2.54,0; 4 0,0; 5 2.54,0; 6 5.08,0; 7 7.62,0
NANO-FIT_VERTICAL-4 = drill 1.2: P$1 -1.25,0; P$2 1.25,0; P$3 -1.25,2.5; P$4 1.25,2.5 | hole 1.3: 0,-1.34

### Placement (x,y rotation side)
$$U$11  9.4,30.48 0 top
$$U$13  22.1,14.73 0 top
C1  10.16,75.44 180 top
C2  10.16,73.41 180 top
C3  17.02,79.25 180 top
C4  17.02,77.22 180 top
C5  29.21,70.87 0 top
C6  30.99,79.25 0 top
C7  30.99,77.22 0 top
C8  57.91,76.2 270 top
C9  60.45,71.63 270 top
C10  62.99,71.63 270 top
C11  15.75,62.48 180 top
C12  15.75,60.45 180 top
C13  23.88,66.55 180 top
C14  23.88,64.52 180 top
C15  29.21,68.83 0 top
C16  29.72,65.02 0 top
C17  29.72,62.99 0 top
C18  57.91,66.55 270 top
C19  60.45,61.72 270 top
C20  62.99,61.72 270 top
C21  10.8,57.66 180 top
C22  10.8,55.63 180 top
C23  20.07,48.77 270 top
C24  25.65,48.77 0 top
C25  29.72,58.93 0 top
C26  29.72,56.9 0 top
C27  30.23,51.82 0 top
C28  30.23,49.78 0 top
C29  57.91,56.64 270 top
C30  64.52,52.07 180 top
C31  64.52,49.53 180 top
C32  11.71,40.77 180 top
C33  11.71,38.73 180 top
C34  18.16,45.59 180 top
C35  18.16,43.56 180 top
C36  28.19,41.66 180 top
C37  28.19,39.62 180 top
C38  33.53,41.4 0 top
C39  33.53,39.37 0 top
C40  25.91,32.39 0 top
C41  25.91,30.35 0 top
C42  28.83,32.39 270 top
C43  30.86,32.39 270 top
C44  15.88,14.48 90 top
C45  18.03,14.48 90 top
C100  58.67,22.1 180 bottom
C101  58.67,24.13 180 bottom
C102  50.8,19.05 270 bottom
C103  50.8,22.61 90 bottom
J1  39.12,80.01 180 top
J2  39.12,76.45 180 top
J3  39.12,72.39 180 top
J4  50.29,78.23 0 top
J5  50.29,74.68 0 top
J6  39.12,68.83 180 top
J7  39.12,64.77 180 top
J8  39.12,61.21 180 top
J9  50.29,69.34 0 top
J10  50.29,65.79 0 top
J11  50.29,60.45 0 top
J12  39.12,57.15 180 top
J13  39.12,53.59 180 top
J14  50.29,56.9 0 top
R1  13.28,77.19 0 top
R2  13.64,79.25 180 top
R3  20.57,78.74 270 top
R4  23.88,79.25 0 top
R5  23.88,77.22 0 top
R6  23.88,74.68 180 top
R7  23.88,72.64 180 top
R8  23.88,70.61 0 top
R9  30.23,74.17 180 top
R10  54.86,77.72 0 top
R11  54.86,75.18 0 top
R12  11.68,68.07 180 top
R13  12.7,62.48 180 top
R14  12.7,60.45 0 top
R15  13.72,65.53 0 top
R16  15.24,68.07 0 top
R17  17.53,65.53 180 top
R18  18.29,61.98 270 top
R19  19.81,68.07 180 top
R20  20.83,62.74 0 top
R21  20.83,60.71 0 top
R22  23.88,68.58 0 top
R23  24.38,60.96 180 top
R24  29.72,60.96 180 top
R25  54.86,68.83 0 top
R26  54.86,66.29 0 top
R27  54.86,59.18 0 top
R28  12.19,51.31 180 top
R29  13.72,49.28 0 top
R30  15.75,51.31 0 top
R31  17.27,49.28 180 top
R32  19.81,51.31 180 top
R33  24.38,58.93 180 top
R34  24.38,56.9 0 top
R35  25.65,54.86 180 top
R36  25.65,52.83 180 top
R37  25.65,50.8 0 top
R38  30.23,53.85 180 top
R39  54.86,56.9 0 top
R40  14.73,45.85 180 top
R41  14.73,43.69 0 top
R42  22.89,45.06 270 top
R43  23.88,40.13 90 top
R44  23.88,37.08 270 top
R45  25.65,45.72 0 top
R46  25.65,43.69 0 top
R47  37.13,37.36 180 top
R48  14.22,34.54 180 top
R49  16.38,32.39 0 top
R50  17.78,34.54 0 top
R51  20.32,32.39 180 top
R52  21.34,34.54 180 top
R53  37.08,35.05 180 top
R54  66.8,29.92 180 top
R55  25.91,14.73 90 top
R100  58.67,26.16 180 bottom
R101  58.67,28.19 180 bottom
R102  58.67,30.23 0 bottom
REG  53.34,21.49 270 top
U1  62.99,76.2 0 top
U2  62.99,66.55 0 top
U3  62.99,56.39 0 top
U$1  13.72,72.64 90 top
U$2  19.3,72.64 90 top
U$3  14.22,55.88 90 top
U$4  19.81,55.88 90 top
U$5  15.24,39.12 90 top
U$6  20.83,39.12 90 top
U$7  30.23,36.32 0 top
U$8  47.5,40.13 0 top
U$9  65.02,46.23 0 top
U$10  65.02,42.67 0 top
U$12  62.99,26.42 90 top
U$14  44.96,7.87 90 top
U$100  33.66,20.14 180 bottom
X7  65.25,36.3 0 top

### Tracks (layer width: path | path; a pad name or v marks a point on that pad's centre or on a via)
+1V65A  (via drill 0.35)
  Top 0.254: R5.2 C7.1 | C7.1 C6.1 | R32.1 20.66,50.21 C23.1 22.43,49.62 23.28,48.77 C24.1 25.58,49.55 27.54,49.55 v27.71,49.38 | C37.1 C36.1 | R21.2 21.69,60.71 23.22,62.23 25.31,62.23 26.33,63.25 28.61,63.25 C17.1 C16.1 28.87,66.31 28.96,66.4 | 32.36,66.4 32.36,49.15 v32,48.79 32,48.62 30.61,47.22 30.61,45.26 29.04,43.7 C36.1 | U$7.1 28.88,39.46 C37.1 | R52.1 22.9,34.54 C40.1 C41.1 24.19,31.22 v23.8,31.22 | v28.08,38.35 29.04,39.32 C37.1 | 28.96,66.4 25.59,66.4 C13.1 C14.1 23.71,63.5 22.35,63.5 20.66,65.19 R19.1 | 28.96,66.4 32.36,66.4 | C7.1 32.36,74.99 32.36,66.4 | R46.2 27.01,43.69 C36.1 | U$100.1 25.91,20.27 22.4,20.27 U$14.A10
  Bottom 0.254: v27.71,49.38 28.17,48.92 31.88,48.92 v32,48.79 | v28.08,38.35 28.08,38.01 23.8,33.73 23.8,32.92 | 23.8,32.92 v23.8,31.22 | 23.8,32.92 19.58,28.7 19.58,23.09 U$14.A10
+3V3  (via drill 0.35)
  Top 0.254: C31.1 C30.1 | U2.4 60.53,63.26 60.5,62.62 C19.1 C20.1 v67.18,62.57 | U3.4 62.95,54.48 C30.1 | C30.1 v67.18,52.07 | v67.18,48.01 67.18,47.24 68.96,45.47 68.96,25.27 65.81,22.12 62.8,22.12 60.41,24.51 U$12.8 56.85,24.51 v56.64,24.71 | U1.4 60.53,72.55 C9.1 C10.1 65.06,72.48 v67.18,70.36 | U$14.3.3V 15.75,18.47 17.02,17.2 v17.02,16.56
  Bottom 0.254: v67.18,48.01 v67.18,52.07 v67.18,62.57 v67.18,70.36 | C101.1 C100.1 55.65,19.93 55.65,18.8 53.71,16.86 17.32,16.86 v17.02,16.56 | v56.64,24.71 57.24,24.71 C101.1 | R100.2 57.82,24.46 C101.1
+3V3A  (via drill 0.35)
  Top 0.254: C1.1 C2.1 | C2.1 12.46,74.85 U$1.8 | R7.1 R8.2 24.98,70.87 C5.1 | v33.22,71.2 33.22,60.12 v33.17,60.07 33.2,60.04 v33.2,48.21 33.2,41.92 C38.1 | 26.5,51.64 R37.2 27.01,50.8 28.03,51.82 C27.1 C28.1 | U$7.5 32.68,38.37 C39.1 C38.1 | 26.5,51.64 23.8,51.64 23.01,52.43 23.01,55.11 23.99,56.08 24.24,56.08 24.75,56.59 24.88,56.59 25.18,56.9 R34.2 R33.1 26.2,59.89 v27.3,59.89 27.94,59.89 28.87,58.97 C25.1 C26.1 | 26.5,51.64 R36.1 | U$3.8 13.25,57.23 C22.1 C21.1 11.18,58.13 v11.18,58.93 | U$5.8 14.27,40.41 12.59,38.73 C33.1 C32.1 11.84,41.49 v11.84,42.16 | v11.02,72.03 C2.1 | v32.05,42.47 32.68,41.85 C38.1 | C15.1 C5.1 | v28.35,72.39 28.36,72.38 C5.1
  Bottom 0.254: v33.22,71.2 32.03,72.39 v28.35,72.39 v28.34,72.39 18.03,72.39 17.63,72.79 11.79,72.79 v11.02,72.03 | v33.17,60.07 32.66,59.56 27.63,59.56 v27.3,59.89 24.03,59.89 23.14,59 18.56,59 18.13,58.58 17.46,58.58 17.1,58.93 v11.18,58.93 | v11.84,42.16 11.84,45.87 13.11,47.14 26.85,47.14 27.81,48.11 33.1,48.11 v33.2,48.21 | U$14.AREF 19.9,20.23 23.41,20.23 24.77,21.59 24.77,25.29 30.71,31.23 30.71,41.13 v32.05,42.47 34.87,42.47 38.42,38.91 40.51,38.91 41.52,37.9 U$8.P$10
+5V
  Top 0.254: $$U$13.3 22.73,13.08 20.49,15.33 C45.2 C44.2 10.67,20.54 U$14.VIN
  Top 0.508: REG.3 49.97,22.32 49.97,26.21 41.13,35.05 R53.1
  Bottom 0.254: REG.3 52.59,18.2 C102.2
  Bottom 0.508: C102.2 50.01,17.41 15.61,17.41 10.67,22.35 U$14.VIN
+5VA  (via drill 0.35)
  Top 0.254: U$2.8 17.87,75.31 C4.1 17.87,79.08 17.95,79.17 | v29.46,80.77 32.51,80.77 34.54,78.74 34.54,61.59 | U$7.3 28.88,33.28 | 28.88,33.28 28.88,33.23 | 28.88,33.28 C42.1 | U$7.4 31.58,35.31 32.26,35.31 35.31,38.35 35.31,44.27 v34.57,45.01 34.54,44.99 34.54,61.59 | C3.1 17.95,79.17 | v18.93,78.37 18.04,79.25 17.95,79.17 | U$4.8 18.11,58.09 16.76,59.44 16.76,60.29 C12.1 C11.1 16.6,60.54 v17.63,59.51 | v34.57,61.59 34.54,61.59 | C34.1 C35.1 19.01,42.17 | U$6.8 19.01,42.17 | 19.01,42.17 18.8,41.96 v18.8,41.39
  Top 0.508: R53.2 33.92,35.05 32.11,33.23 C43.1 | U$7.4 31.58,33.95 C43.1 | C43.1 28.88,33.23
  Bottom 0.254: v18.93,78.37 21.33,80.77 v29.46,80.77 | v17.63,59.51 17.63,59.69 17.76,59.82 22.73,59.82 24.38,61.47 34.44,61.47 v34.57,61.59 | v18.8,41.39 18.8,41.35 26.36,41.35 30.28,45.26 34.31,45.26 v34.57,45.01
+12V
  Top 0.254: X7.P$1 63.98,36.32
  Top 0.406: U$8.P$16 50.86,37.23 51.16,37.23 52.06,36.32 63.98,36.32 63.98,37.05 62.75,38.28 62.75,40.4 U$10.P$1
  Top 0.508: U$8.P$16 48.72,37.08 U$8.P$21
  Top 0.61: U$8.P$9 44.35,36.12 44.68,36.45 46.86,36.45 U$8.P$21
  Top 1.27: U$8.P$9 44.3,34.52 53.34,25.48 REG.1
  Bottom 0.254: REG.1 51.37,24.03 C103.2
AGND  (via drill 0.35)
  Top 0.254: C3.2 C4.2 16.91,76.47 16.91,71.86 16.26,71.21 v16.26,70.61 16.08,70.43 U$1.4 | R22.1 23.03,68.83 23.55,69.36 26.39,69.36 27.69,68.06 29.28,68.06 C15.2 C5.2 30.17,70.76 v31.5,69.98 31.33,69.98 31.33,73.66 31.08,73.91 R9.1 | U$2.4 v21.23,69.49 21.48,69.49 22.39,68.58 R22.1 | C6.2 C7.2 32.26,77.22 33.91,75.56 33.91,70.1 | 33.91,70.1 33.91,57.91 v33.89,57.91 33.89,41.89 C38.2 C39.2 34.38,38.44 32.26,36.32 U$7.2 | C11.2 C12.2 17.27,58.08 17.27,55.37 | C25.2 C26.2 | C16.2 C17.2 R24.1 30.57,61.12 v31.63,62.18 | C21.2 C22.2 11.34,54.23 v11.34,53.85 13.12,55.63 17.02,55.63 17.27,55.37 | v33.89,70.1 33.91,70.1 | U$4.4 20.79,54.65 20.07,55.37 17.27,55.37 | C34.2 C35.2 17.31,43.42 17.93,42.8 17.93,41.35 | R44.1 23.88,38.1 | 23.88,38.1 R43.1 27,39.28 C37.2 | C32.2 C33.2 v12.43,37.17 12.67,37.17 15.13,39.62 16.2,39.62 17.93,41.35 | U$6.4 23,38.1 23.88,38.1 | 17.93,41.35 17.93,41 18.54,40.39 18.54,39.62 16.22,37.3 U$5.4 | v35.64,36.17 36.29,36.82 R47.2 36.29,39 39.45,42.16 v40.39,42.16 35.31,47.24 v35.31,62.48 | v9.93,70.99 9.31,71.61 C2.2 C1.2 | v10.67,46.74 11.85,47.92 C23.2 25.65,47.92 C24.2 26.76,48.51 29.81,48.51 C28.2 C27.2 R38.1 30.57,54.36 C26.2 | C37.2 C36.2 | C37.2 27.34,37.17 28.19,36.32 U$7.2 | U$7.2 27.69,36.32 26.76,35.39 C40.2 | v33.27,32 32.93,32 32.46,31.54 C43.2 C42.2 27.61,31.54 C40.2 | R22.1 C13.2 C14.2 | C41.2 C40.2 | v31.7,57.78 30.81,56.9 C26.2 | 17.27,55.37 17.22,55.32 17.22,54.54 16.83,54.16 15.68,54.16 U$3.4
  Bottom 0.254: v33.89,70.1 33.63,70.1 33.51,69.98 v31.5,69.98 | v33.89,57.91 32.05,57.91 31.92,57.78 v31.7,57.78 | v9.93,70.99 11.2,70.99 11.84,71.63 15.24,71.63 v16.26,70.61 17.78,69.09 20.83,69.09 v21.23,69.49 24.43,69.49 25.49,68.43 36.02,68.43 37.41,67.03 39.12,67.03 | v12.43,37.17 10.67,38.93 v10.67,46.74 11.34,47.41 11.34,51.05 | 11.34,51.05 v11.34,53.85 | U$14.AGND 13.21,26.42 17.12,26.42 17.12,21.36 18.73,19.75 24.07,19.75 25.68,18.14 42.41,18.14 42.41,32.29 41.05,33.66 36.5,33.66 35.64,34.52 v35.64,36.17 35.64,34.37 v33.27,32 | v47.24,67.31 46.76,67.79 41.58,67.79 40.82,67.03 39.12,67.03 | v47.24,67.31 46.48,68.07 v46.48,76.45 | v50.29,58.67 50.06,58.9 50.06,61.64 47.24,64.47 v47.24,67.31 | 39.12,67.03 39.12,73.36 39.95,74.19 40.82,74.19 41.43,73.58 41.43,71.5 v41.76,71.17 | v17.78,51.05 11.34,51.05 | v35.31,62.48 31.93,62.48 v31.63,62.18
  other vias: 24.97,62.97 9.14,66.29 18.29,29.46 21.84,77.39 21.13,44.58 47.75,58.67 21.64,29.24 14.66,26.8 11.63,29.77 8.18,33.43 10.95,35.51 12.47,33.6 10.24,48.16 9.91,53.09 9.7,63.96 8.48,68.94 9.35,59.84 10.77,44.4 10.19,43.15 14.22,33.27
  pour Top: 6.86,77.5 6.86,26.16 11.68,26.16 11.68,22.35 14.73,22.35 14.73,25.91 16.69,25.91 16.69,19.41 24.18,19.41 25.7,17.88 42.85,17.88 42.85,31.83 40.89,33.78 37.11,33.78 37.11,38.2 39.73,38.2 41.1,36.83 43.59,36.83 43.89,37.13 46.33,37.13 46.61,37.41 46.61,37.59 47.04,38.02 47.04,38.43 46.56,38.91 46.56,39.75 47.12,40.31 47.88,40.31 49,39.19 50.32,39.19 50.65,38.86 53.7,38.86 54.84,40.01 54.84,48.77 54.31,49.3 54.31,51.82 56.85,54.36 58.98,54.36 59.79,55.17 61.87,55.17 61.87,57.68 59.31,57.68 58.95,58.04 58.95,64.8 59.44,65.28 61.77,65.28 61.77,67.77 59.54,67.77 58.78,68.53 58.78,74.19 59.51,74.93 61.8,74.93 61.8,77.5 59.61,77.5 54.66,82.47 11.84,82.47 6.88,77.5
  pour Bottom: 11.68,26.16 11.68,22.35 14.73,22.35 14.73,25.91 16.69,25.91 16.69,19.41 24.18,19.41 25.7,17.88 42.85,17.88 42.85,31.83 40.89,33.78 37.11,33.78 37.11,38.2 39.73,38.2 41.1,36.83 43.59,36.83 43.89,37.13 46.33,37.13 46.61,37.41 46.61,37.59 47.04,38.02 47.04,38.43 46.56,38.91 46.56,39.75 47.12,40.31 47.88,40.31 49,39.19 50.32,39.19 50.65,38.86 53.7,38.86 54.84,40.01 54.84,48.77 54.31,49.3 54.31,51.82 56.85,54.36 58.98,54.36 59.79,55.17 61.87,55.17 61.87,57.68 59.31,57.68 58.95,58.04 58.95,64.8 59.44,65.28 61.77,65.28 61.77,67.77 59.54,67.77 58.78,68.53 58.78,74.19 59.51,74.93 61.8,74.93 61.8,77.5 59.61,77.5 54.66,82.47 11.84,82.47 6.86,77.5 6.86,26.16
CANH  (via drill 0.35)
  Top 0.254: $$U$13.7 21.46,15.62 23.2,13.88 R55.1 26,13.97 v27.18,13.97
  Bottom 0.254: v27.18,13.97 27.84,13.31 54.52,13.31 62.33,21.12 62.33,36.93 63.02,37.62 64.49,37.62 65.67,38.8 X7.P$4 65.32,39.98 63.51,39.98 61.43,37.9 U$8.P$5
CANL  (via drill 0.35)
  Top 0.254: $$U$13.6 22.73,16.38 23.53,15.58 R55.2 27.09,15.58 v27.18,15.49
  Bottom 0.254: v27.18,15.49 28.96,13.72 54.36,13.72 61.88,21.25 61.88,37.23 61.62,37.49 | U$8.P$6 51.87,36.12 53.24,37.49 61.62,37.49 | X7.P$3 62.93,38.8 61.62,37.49
CANRX
  Top 0.254: $$U$13.4 24,9.78 U$14.D4(CANRX)
CANTX
  Top 0.254: U$14.D3(CANTX) 20.19,9.78 $$U$13.1
CS1
  Top 0.254: U1.6 69.01,75.56 70.99,73.58 70.99,23.27 58.6,10.87 37.47,10.87 36.07,9.47 U$14.D9(RX2)
CS2
  Top 0.254: U2.6 68.88,65.91 70.49,64.31 70.49,24.12 58.15,11.79 35.79,11.79 33.53,9.53 U$14.D8(TX3)
CS3
  Top 0.254: U3.6 65.58,55.63 69.14,55.63 69.98,54.79 69.98,24.95 57.73,12.7 33.93,12.7 30.99,9.75 U$14.D7(RX3)
GND  (via drill 0.35, 0.51)  (1 unrouted)
  Top 0.254: C30.2 C31.2 64.44,48.75 | C20.2 C19.2 60.53,60.8 U3.1 61.42,59.18 v69.26,59.18 | C10.2 C9.2 60.45,68.53 U2.1 61.67,69.6 v69.26,69.6 | U$14.GND 15.15,13.63 C44.1 C45.1 20.57,13.63 21.46,12.74 $$U$13.2 | v69.26,48.77 69.25,48.75 64.44,48.75 | $$U$13.8 19.07,16.2 v19,16.2 | v69.29,77.17 69.29,77.34 69.14,77.5 62.41,77.5 61.8,78.11 U1.1 | R54.2 65.7,29.67 65.7,28.43 U$12.4 | R54.2 65.95,31.55 67.06,32.65 67.06,34.54 67.05,34.55 67.05,35.7 66.5,36.24 X7.P$2 66.5,37.13 67.68,38.31 67.68,45.51 | v59.44,20.83 58.78,21.49 REG.2 | R54.2 62.43,29.92 v61.15,31.2 | 64.44,48.75 67.68,45.51 | U$9.P$1 65.02,45.51 67.68,45.51
  Top 0.508: REG.2 51.65,23.18 51.65,25.58 39.86,37.36 R47.1
  Bottom 0.254: U$14.GND 12.25,7.56 17.27,7.56 | v19,16.2 17.27,14.48 17.27,7.56 | v69.29,77.17 v69.29,74.3 69.29,69.62 v69.26,69.6 v69.26,59.18 v69.26,48.77 69.97,48.06 69.97,22.92 54.61,7.56 17.27,7.56 | C103.1 50.8,21.08 51.05,20.83 50.8,20.57 | C102.1 50.8,20.57 | R102.1 R101.2 59.52,27.61 60.35,26.78 60.35,25.55 59.52,24.72 C101.2 C100.2 59.44,22.01 v59.44,20.83 | v61.15,31.2 61.15,31.09 60.29,30.23 R102.1 | R102.1 59.44,30.23 v58.17,31.5 | v49.28,20.57 50.8,20.57
  Bottom 0.356: 47.92,35.97 47.94,36 47.95,36 48.29,36.34 48.47,36.34
  Bottom 0.406: 47.92,35.97 47.53,35.59 47.53,34.66 47.5,34.63
  Bottom 0.508: 47.49,34.24 47.49,34.62 47.5,34.63
  Bottom 0.61: U$8.P$20 48.65,38.22 48.65,37.73 49.02,37.35 49.02,36.58 48.79,36.34 48.47,36.34
  Bottom 0.813: 47.49,34.24 49.28,32.45 49.28,22.94 50.72,21.49 51.31,21.49 | REG.2 51.31,21.49 | C102.1 50.8,20.98 51.31,21.49
  other vias: 69.32,57.48 69.29,54.48 46.99,15.49 69.27,67.87 69.27,64.59 63.53,28.96 56.13,29.46 64.69,29.92 65.94,31.24 64.01,77.47 63.75,74.17 63.75,67.31 63.75,64.77 63.75,57.15 63.75,54.86 63.04,23.04 67.56,25.15 12.95,21.34 27.23,12.83 24.89,11.43 19.15,11.4 60.6,29.21 2.54,7.62 2.54,10.16 2.54,12.7 2.54,15.24 2.54,17.78 2.54,20.32 2.54,22.86 2.54,25.4 2.54,27.94 2.54,30.48 2.54,33.02 2.54,35.56 2.54,38.1 2.54,40.64 2.54,43.18 2.54,45.72 2.54,48.26 2.54,50.8 2.54,53.34 2.54,55.88 2.54,58.42 2.54,60.96 2.54,63.5 2.54,66.04 2.54,68.58 2.54,71.12 2.54,73.66 2.54,76.2 2.54,78.74 2.54,81.28 9.91,86.61 12.45,86.61 14.99,86.61 17.53,86.61 20.07,86.61 22.61,86.61 25.15,86.61 27.69,86.61 30.23,86.61 32.77,86.61 35.31,86.61 37.85,86.61 40.39,86.61 42.93,86.61 45.47,86.61 48.01,86.61 50.55,86.61 53.09,86.61 55.63,86.61 58.17,86.61 60.71,86.61 63.25,86.61 65.79,86.61 68.33,86.61 70.87,86.61 76.2,79.25 76.2,76.71 76.2,74.17 76.2,71.63 76.2,69.09 76.2,66.55 76.2,64.01 76.2,61.47 76.2,58.93 76.2,56.39 76.2,53.85 76.2,51.31 76.2,48.77 76.2,46.23 76.2,43.69 76.2,41.15 76.2,38.61 76.2,36.07 76.2,33.53 76.2,30.99 76.2,28.45 76.2,25.91 76.2,23.37 76.2,20.83 76.2,18.29 76.2,15.75 76.2,13.21 76.2,10.67 76.2,8.13 69.09,2.54 66.55,2.54 64.01,2.54 61.47,2.54 58.93,2.54 56.39,2.54 53.85,2.54 51.31,2.54 48.77,2.54 46.23,2.54 43.69,2.54 41.15,2.54 38.61,2.54 36.07,2.54 33.53,2.54 30.99,2.54 28.45,2.54 25.91,2.54 23.37,2.54 20.83,2.54 18.29,2.54 15.75,2.54 13.21,2.54 10.67,2.54 8.13,2.54 67.56,31.24 50.57,32.28
  pour Top (rank 2): -0.03,89.05 -0.03,0.1 78.71,0.1 78.71,89.05
  pour Bottom (rank 2): -0.03,0.1 78.71,0.1 78.71,89.05 -0.03,89.05
MISO  (via drill 0.35)
  Top 0.254: v68.6,56.77 68.35,57.02 U3.7 | U2.7 v68.6,67.18 | v68.6,76.33 68.15,76.78 65.61,76.78 65.56,76.84 U1.7
  Bottom 0.254: v68.6,76.33 v68.6,67.18 v68.6,56.77 68.6,48.39 69.47,47.52 69.47,23.61 55.03,9.17 43.69,9.17 U$14.D12
N$1
  Top 0.254: U$6.1 19.85,35.77 R50.2 18.63,33.23 R51.2
N$2
  Top 0.254: R10.2 57.24,77.72 C8.1 58.13,76.84 U1.2
N$3
  Top 0.254: U$6.2 20.5,34.56 R52.2 21.17,33.86 R51.1 21.17,31.84 20.45,31.12 18.5,31.12 R49.2
N$4
  Top 0.254: R40.2 14.14,45.85 15.07,46.78 25.45,46.78 R45.2 26.5,45.39 R46.1 23.79,42.67 21.59,42.67 21.15,42.23 U$6.6
N$5
  Top 0.254: R50.1 16.93,33.78 R49.1 15.07,32.84 R48.1 14.91,34.7 U$5.2
N$6
  Top 0.254: R11.2 57.75,75.18 C8.2 58.13,75.56 U1.3
N$8
  Top 0.254: U$6.7 20.5,42.35 22.37,44.21 R42.2 23.39,44.21 24.8,45.62 R45.1
N$9
  Top 0.254: U$5.6 15.58,41.34 R41.2 R40.1 16.12,45.85 16.65,46.37 22.42,46.37 R42.1
N$10
  Top 0.254: R17.1 18.38,67.49 R19.2 18.96,70.42 U$2.2 18.98,71.45 18.8,71.63 18.21,71.63 17.12,70.53 17.12,69.86 16.09,68.83 R16.2
N$11
  Top 0.254: U$2.6 19.63,75.55 20.51,76.43 22.24,76.43 R5.1 24.73,78.92 R4.2 24.73,79.5 23.25,80.98 14.26,80.98 12.79,79.5 R2.2
N$12
  Top 0.254: R15.2 R17.2 16.68,66.46 17.53,67.31 17.53,68.87 18.33,69.67 U$2.1
N$13
  Top 0.254: U$1.2 13.39,68.93 12.62,68.16 | 12.62,68.16 R12.1 | R15.1 12.78,65.61 12.78,65.7 14.39,67.31 R16.1 12.7,68.07 12.62,68.16
N$14
  Top 0.254: U$2.7 18.98,76.3 19.43,76.75 R3.2 21.08,77.89 22.44,79.25 R4.1
N$15
  Top 0.254: R25.2 56.22,68.83 57.66,67.4 C18.1 58.13,67.18 U2.2
N$16
  Top 0.254: R26.2 55.79,66.29 56.13,65.95 57.91,65.95 C18.2 58.13,65.91 U2.3
N$17
  Top 0.254: U$4.2 19.49,52.59 18.96,52.07 R32.2 18.96,50.12 R31.1 18.12,49.02 17.6,48.5 15.76,48.5 14.98,49.28 R29.2
N$18
  Top 0.254: R13.2 11.85,63.25 12.78,64.18 20.74,64.18 21.68,63.25 R20.2 19.85,60.91 19.85,60.83 R21.1 20.14,60.55 U$4.6
N$19
  Top 0.254: R31.2 16.6,49.45 R30.2 16.6,51.43 U$4.1
N$21
  Top 0.254: R28.1 13.21,51.31 | 13.21,51.31 R30.1 R29.1 | U$3.2 13.9,52 13.21,51.31
N$22
  Top 0.254: R20.1 19.98,62.49 18.62,61.13 R18.2 18.29,60.58 19.49,59.38 U$4.7
N$23
  Top 0.254: U$3.6 14.39,58.25 14.39,58.9 13.55,59.75 R14.2 R13.1 13.55,62.58 14.74,63.77 17.34,63.77 R18.1
N$25
  Top 0.254: R27.2 56.22,59.18 C29.1 58.38,57.02 U3.2
N$26
  Top 0.254: U3.3 57.95,55.75 C29.2 56.64,55.79 55.63,56.81 R39.2
N$77
  Top 0.254: R3.1 19.59,80.57 15.24,80.57 14.49,79.82 R2.1 14.49,77.55 R1.2 14.04,77.1 U$1.6
SCK  (via drill 0.35)
  Top 0.254: U3.5 65.48,54.46 v67.94,54.46 | U2.5 v67.94,64.64 | U1.5 v67.94,74.3 | v67.95,47.49 69.47,45.96 69.47,25.02 61.37,16.92 49.78,16.92 48.26,18.44 48.26,19.81 U$14.D13
  Bottom 0.254: v67.94,74.3 v67.94,64.64 v67.94,54.46 v67.94,47.49 v67.95,47.49
SG1_GND*  (via drill 0.35)
  Top 0.254: R44.2 24.35,36.23 v26.62,38.51
  Bottom 0.254: U$8.P$17 44.26,39.1 41.91,39.1 41.29,39.73 38.95,39.73 35.14,43.54 31.11,43.54 26.62,39.05 v26.62,38.51
SG1_V+  (via drill 0.35)
  Top 0.254: U$6.3 21,37.06 21,37.72 20.11,38.61 v18.54,38.61
  Bottom 0.254: v18.54,38.61 19.56,39.62 26.59,39.62 30.91,43.94 35.31,43.94 39.12,40.13 U$8.P$11
SG1_V-  (via drill 0.35)
  Top 0.254: U$5.3 15.56,37.92 v17.53,39.88
  Bottom 0.254: v17.53,39.88 17.78,40.13 26.49,40.13 30.71,44.35 35.47,44.35 39.28,40.54 41.31,40.54 41.31,40.56 42.88,42.13 U$8.P$22
SG1_VOUT
  Top 0.254: U$5.1 14.27,35.44 R48.2 13.14,34.31 13.14,33.3 17.9,28.55 32.03,28.55 36.07,24.51 U$14.A2
  Bottom 0.254: U$100.7 41.27,20.7 39.62,22.35 37.95,22.35 36.07,24.23 U$14.A2
SG2_GND*  (via drill 0.35)
  Top 0.254: v26.07,42.01 25.42,41.36 24.25,41.36 R43.2
  Bottom 0.254: U$8.P$18 44.53,42.45 43.29,43.69 38.1,43.69 35.51,46.28 30.01,46.28 26.07,42.34 v26.07,42.01
SG2_V+  (via drill 0.35)
  Top 0.254: U$6.5 22.49,42.01 v25.15,42.01
  Bottom 0.254: v25.15,42.01 29.82,46.69 35.68,46.69 38.22,44.15 U$8.P$12
SG2_V-  (via drill 0.35)
  Top 0.254: U$5.5 16.69,41.33 17.13,41.77 v17.27,41.77
  Bottom 0.254: v17.27,41.77 18.18,42.67 25.23,42.67 29.65,47.09 35.85,47.09 38.39,44.55 43.24,44.55 43.88,45.19 46.3,45.19 U$8.P$13
SG2_VOUT
  Top 0.254: U$5.7 14.76,41.48 14.76,42.14 13.88,43.02 R41.1 11.68,43.69 9.89,41.9 9.89,35.25 17.12,28.02 29.97,28.02 33.53,24.45 U$14.A3 33.53,24.21 35.35,22.39 36.99,22.39 38.73,20.65 U$100.6
SNR3_SG_GND*  (via drill 0.35)
  Top 0.254: R35.1 27.52,53.85 R38.2 v28.17,55.07
  Bottom 0.254: J12.2 36.04,55.07 v28.17,55.07
SRN1-1  (via drill 0.35)
  Top 0.254: J5.1 44.2,74.68 v43.69,74.17 43.31,74.17 43.31,51.05 48.64,45.72 U$8.P$1
  Bottom 0.254: J2.1 41.4,76.45 v43.69,74.17 43.69,72.14 J6.1
SRN1-2
  Top 0.254: U$8.P$14 48.64,43.67 47.61,44.71 47.61,46.12 42.9,50.83 42.9,72.39 | J4.1 44.7,78.23 43.43,76.96 | 42.9,72.39 42.9,74.4 43.43,74.93 43.43,76.96 | J1.1 43.43,76.96 | J3.1 42.9,72.39
SRN1_SG_GND*  (via drill 0.35)
  Top 0.254: R6.1 24.98,74.42 29.12,74.42 R9.2 29.72,74.51 29.72,75.44 v29.97,75.69
  Bottom 0.254: J2.2 30.73,76.45 v29.97,75.69
SRN1_SG_V+  (via drill 0.35)
  Top 0.254: R8.1 23,70.61 21.3,72.32 21.3,73.84 U$2.5 21.53,74.85 v21.53,74.72
  Bottom 0.254: v21.53,74.72 26.46,74.72 31.75,80.01 J1.2
SRN1_SG_V-  (via drill 0.35)
  Top 0.254: R7.2 R6.2 23.37,75.02 23.37,75.82 v23.29,75.89 | U$1.5 15.53,75.69 v15.75,75.69
  Bottom 0.254: v15.75,75.69 15.95,75.89 v23.29,75.89
SRN1_SG_VOUT
  Top 0.254: R1.1 13.39,76.23 U$1.7 13.39,72.7 8.19,67.5 8.19,34.54 16.34,26.39 21.36,26.39 U$14.A7 23.37,24.21 25.19,22.39 27.32,22.39 28.58,21.13 U$100.2
SRN1_T+
  Top 0.254: R11.1 53.51,74.68 J5.2
SRN1_T-
  Top 0.254: J4.2 53.51,78.23 R10.1
SRN1_WB_GND*  (via drill 0.35)
  Top 0.254: v31.5,67.06 31.17,67.39 25.92,67.39 R22.2 | v36.07,66.8 40.59,66.8 42.49,64.9 42.49,50.37 v42.46,50.34
  Bottom 0.254: U$8.P$19 46.35,43.67 47.39,44.71 47.39,45.83 42.88,50.34 v42.46,50.34 | v36.07,66.8 31.5,66.8 v31.5,67.06
SRN1_WB_V+  (via drill 0.35)
  Top 0.254: U$2.3 19.47,70.59 19.47,72.38 v20.22,73.13
  Bottom 0.254: v20.22,73.13 20.85,73.76 36.47,73.76 J3.2
SRN1_WB_V-  (via drill 0.35)
  Top 0.254: U$1.3 14.2,70.59 14.2,71.25 15.08,72.14 v16.26,72.14
  Bottom 0.254: J6.2 25.65,68.83 23.19,71.3 17.09,71.3 v16.26,72.14
SRN1_WB_VOUT
  Top 0.254: U$1.1 12.43,70.43 10.83,68.83 R12.2 10.83,63.92 8.6,61.68 8.6,34.79 16.59,26.8 23.49,26.8 U$14.A6
  Bottom 0.254: U$100.3 31.12,20.45 29.21,22.35 27.81,22.35 25.91,24.26 U$14.A6
SRN2-1  (via drill 0.35)
  Top 0.254: J10.1 v45.79,65.79 45.54,65.79 45.54,51.05 50.7,45.89 U$8.P$2
  Bottom 0.254: v45.79,65.79 44.96,65.79 J8.1
SRN2-2  (via drill 0.35)
  Top 0.254: J9.1 47.88,69.34 v45.67,67.13 45.14,66.6 45.14,50.88 49.67,46.34 49.67,44.71 49.66,44.7 49.66,43.72 50.47,42.91 U$8.P$15
  Bottom 0.254: J7.1 42.75,67.13 v45.67,67.13
SRN2_SG_GND*  (via drill 0.35)
  Top 0.254: R24.2 R23.1 26.46,62.18 v26.98,62.18
  Bottom 0.254: v26.98,62.18 28.4,63.6 36.68,63.6 J7.2
SRN2_SG_V+  (via drill 0.35)
  Top 0.254: U$4.5 20.82,58.09 22.1,56.81 v22.1,56.57 23.2,56.57 R34.1
  Bottom 0.254: J8.2 37.34,61.21 34.77,58.65 29.03,58.65 26.95,56.57 v22.1,56.57
SRN2_SG_V-  (via drill 0.35)
  Top 0.254: R23.2 R33.2 23.53,58.71 v22.76,57.94 | v16.43,56.97 15.31,58.09 U$3.5
  Bottom 0.254: v16.43,56.97 21.24,56.97 22.21,57.94 v22.76,57.94
SRN2_SG_VOUT
  Top 0.254: U$3.7 13.9,58.75 13.58,59.07 13.23,59.07 R14.1 11.09,60.45 9.04,58.41 9.04,34.94 16.78,27.2 26.04,27.2 28.45,24.79 U$14.A5 28.45,24.19 30.25,22.39 32.17,22.39 33.66,20.9 U$100.4
SRN2_T+
  Top 0.254: R26.1 53.51,65.79 J10.2
SRN2_T-
  Top 0.254: J9.2 53.51,69.34 R25.1
SRN3-1  (via drill 0.35)
  Top 0.254: J14.1 48.29,56.9 47.47,56.08 v47.47,56.06 47.19,55.78 47.19,50.66 53.15,44.7 53.15,41.94 52.65,41.44 U$8.P$4
  Bottom 0.254: v47.47,56.06 43.13,56.06 J13.1
SRN3-2  (via drill 0.35)
  Top 0.254: J11.1 48.11,60.45 46.76,59.11 v46.76,57.2 46.76,50.52 52.71,44.58 52.71,42.95 U$8.P$3
  Bottom 0.254: v46.76,57.2 45.8,58.17 41.68,58.17 J12.1
SRN3_SG_V+  (via drill 0.35)
  Top 0.254: R37.1 22.75,50.8 v22.15,51.41 20.86,52.69 20.45,52.69 20.29,52.86 20.29,53.52 U$4.3
  Bottom 0.254: J13.2 36.09,51.56 22.3,51.56 v22.15,51.41
SRN3_SG_V-  (via drill 0.35)
  Top 0.254: R35.2 R36.2 23.91,53.72 v23.7,53.72 | U$3.3 14.55,54.68 14.55,54.69 16.43,54.69 v16.56,54.81
  Bottom 0.254: v23.7,53.72 23.7,53.78 22.66,54.81 v16.56,54.81
SRN3_SG_VOUT
  Top 0.254: U$3.1 12.94,53.67 11.34,52.07 R28.2 9.48,49.45 9.48,35.08 16.95,27.61 27.89,27.61 30.99,24.51 U$14.A4
  Bottom 0.254: U$100.5 36.2,20.45 34.29,22.35 32.97,22.35 30.99,24.33 U$14.A4
SRN3_T+
  Top 0.254: 54.22,57.1 R39.1 J14.2
SRN3_T-
  Top 0.254: R27.1 53.25,59.94 52.07,59.94 J11.2
V_DIV  (via drill 0.35)
  Top 0.254: U$12.2 63.63,25.78 62.36,27.05 U$12.6 60.29,27.15 v56.76,27.15
  Bottom 0.254: R101.1 56.78,27.15 v56.76,27.15 56.83,27.15 R100.1
WS1  (via drill 0.35)
  Top 0.254: U$12.1 65.54,24.46 65.54,23.57 v65.28,23.31
  Bottom 0.254: U$14.D6 28.45,10.16 29.77,11.48 55.5,11.48 65.28,21.27 v65.28,23.31
WS1_OUT
  Top 0.406: U$8.P$7 50.75,33.02 58.19,33.02 64.16,27.05 U$12.3 66.48,27.05 67.65,28.22 R54.1
WS2  (via drill 0.35)
  Top 0.254: U$12.7 62.38,25.78 63.52,24.64 v63.71,24.64
  Bottom 0.254: U$14.D5 25.91,10.41 27.89,12.4 55,12.4 63.71,21.11 v63.71,24.64
WS2_OUT  (via drill 0.35)
  Top 0.406: U$8.P$8 49.99,31.5 v55.44,31.5 58.61,28.32 U$12.5
  Bottom 0.508: R102.2 56.55,31.5 v55.44,31.5

### Text on the board
tNames: SENSOR 1 | Single SG | WB | SENSOR 2 | THERMOCOUPLES | Single SG | SENSOR 3 | Single SG | GND | WB 2 | +12V | WB 1 | PERMANENT WB | ANALOG / POWER | AGND | A3.3V | WHEEL / SPEED | CAN | 1.65V | SNR 1 SG | SNR 1 WB | SNR 2 SG | SNR 3 SG | WB 2 | WB 1
bNames: WHEEL / SPEED | AGND | MAIN / POWER | A3.3V | 1.65V | SNR 1 SG | SNR 1 WB | SNR 2 SG | SNR 3 SG | WB 2 | WB 1
tDocu: Designed by / Ethan Weinstock | HyTech Racing 2020 / Telemetry ECU rev2